# Altium project GameBoard_V1I1.PrjPcb (part 5 of 20)

## Sheet [11] - CPU - JTAG, CONTROL.SchDoc
size A2; DocumentNumber: 11; SheetNumber: 11; SheetTotal: 32
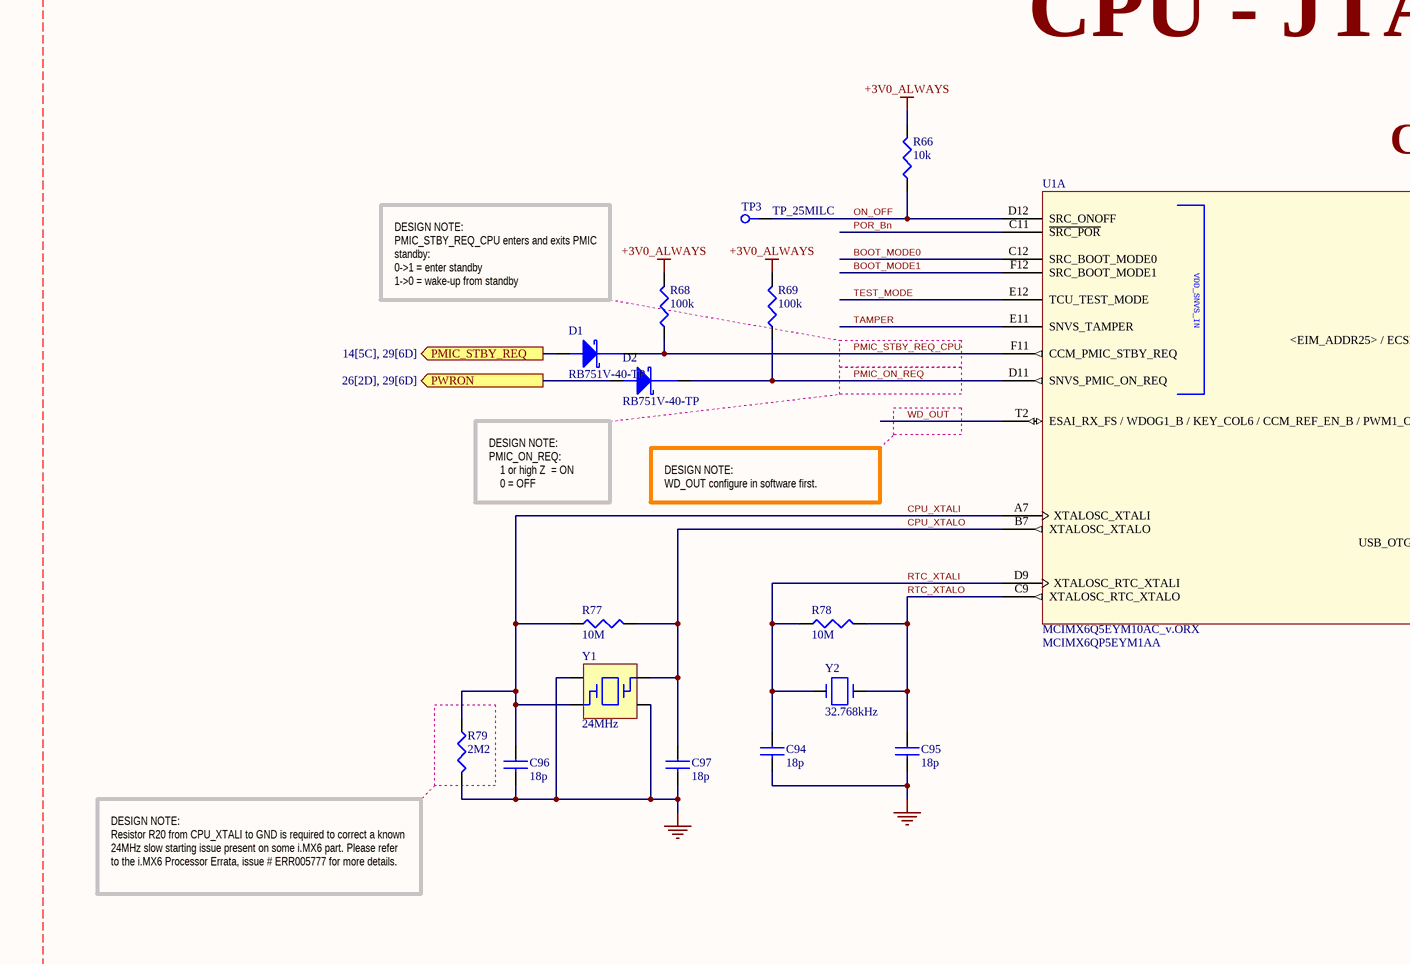
[diagram p30: [11] - CPU - JTAG, CONTROL.SchDoc, top left]
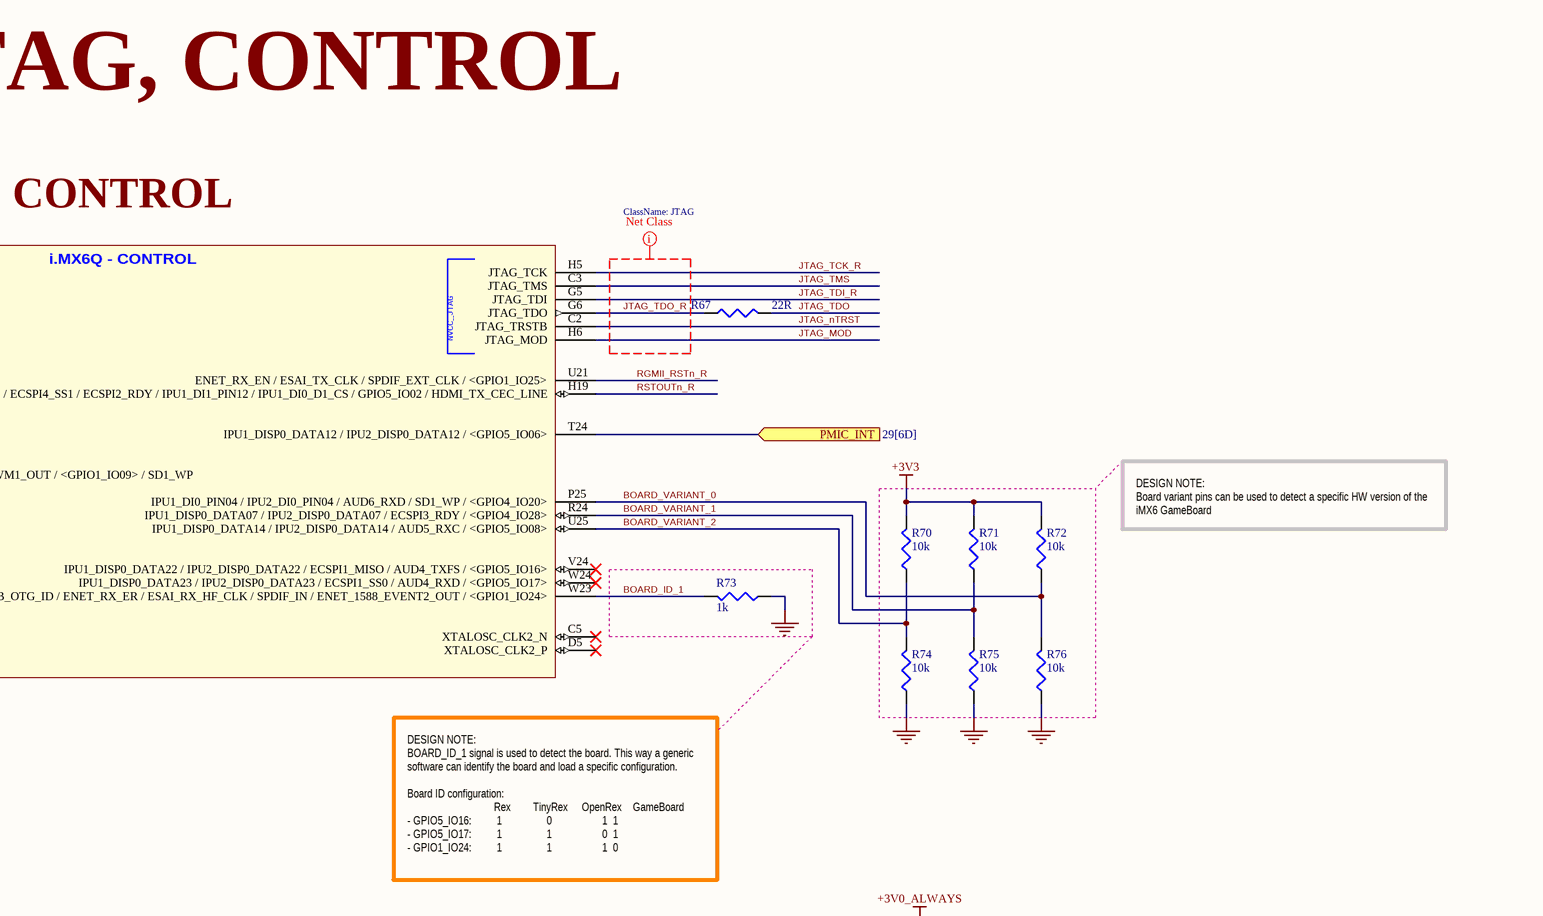
[diagram p31: [11] - CPU - JTAG, CONTROL.SchDoc, top right]
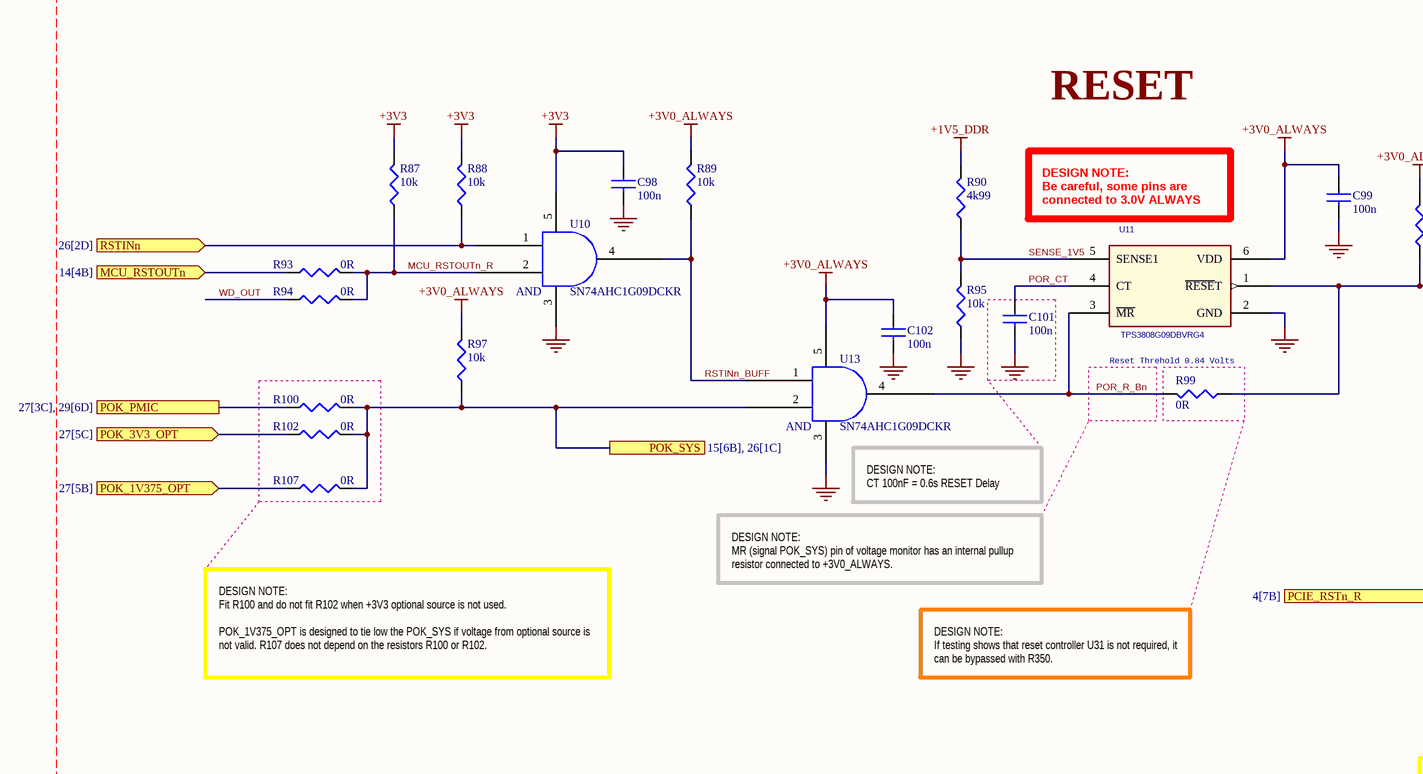
[diagram p32: [11] - CPU - JTAG, CONTROL.SchDoc, bottom left]
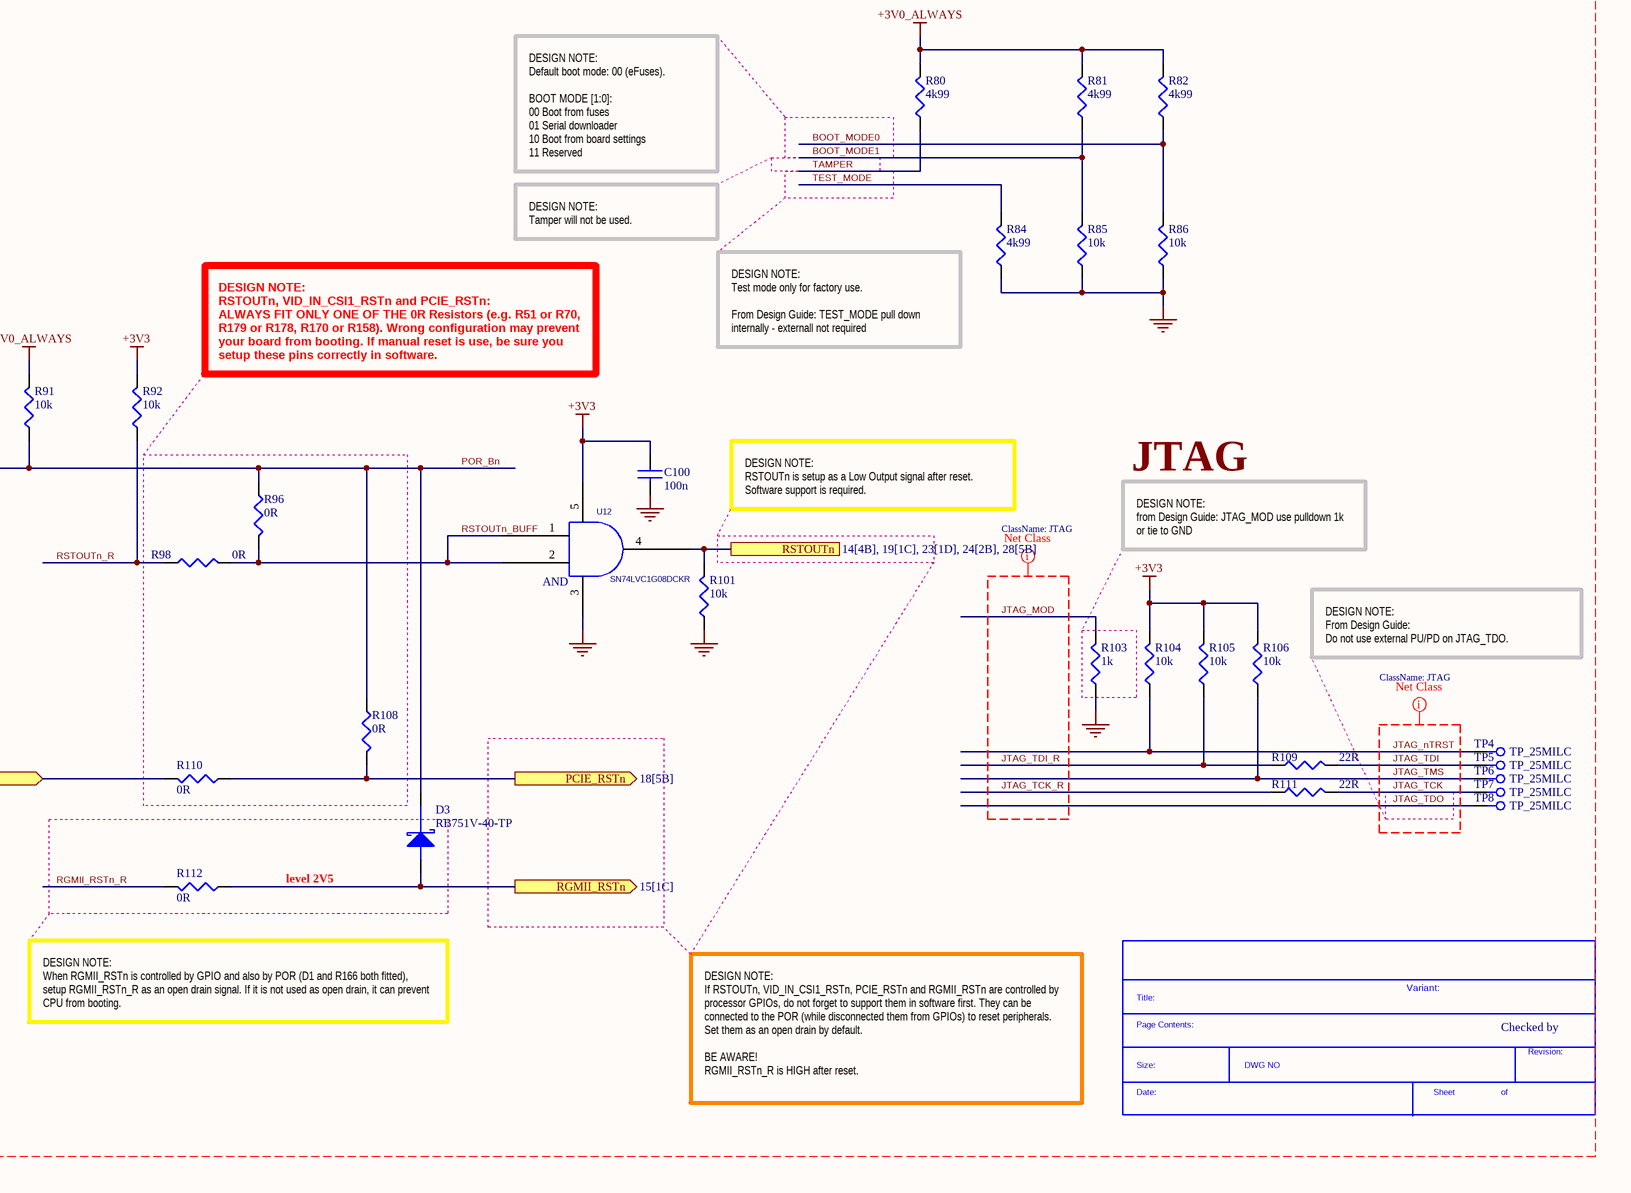
[diagram p33: [11] - CPU - JTAG, CONTROL.SchDoc, bottom right]

### Parts
(Parts that share a designator on the sheet are numbered #1, #2 ... from top to bottom, then left to right.)
*#11  SDTitleBlock  (value not drawn)  (graphical)
C94  18p  [C0201]
C95  18p  [C0201]
C96  18p  [C0402]
C97  18p  [C0402]
C98  100n  [C0402]
C99  100n  [C0402]
C100  100n  [C0402]
C101  100n  [C0402]
C102  100n  [C0402]
D1  RB751V-40-TP  [SOD323]
D2  RB751V-40-TP  [SOD323]
D3  RB751V-40-TP  [SOD323]
R66  10k  [R0402]
R67  22R  [R0402]
R68  100k  [R0402]
R69  100k  [R0402]
R70  10k  [R0402]
R71  10k  [R0402]
R72  10k  [R0402]
R73  1k  [R0402]
R74  10k  [R0402]
R75  10k  [R0402]
R76  10k  [R0402]
R77  10M  [R0402]
R78  10M  [R0201]
R79  2M2  [R0402]
R80  4k99  [R0201]
R81  4k99  [R0402]
R82  4k99  [R0402]
R84  4k99  [R0201]
R85  10k  [R0402]
R86  10k  [R0402]
R87  10k  [R0402]
R88  10k  [R0402]
R89  10k  [R0402]
R90  4k99  [R0402]
R91  10k  [R0402]
R92  10k  [R0402]
R93  0R  [R0402]
R94  0R  [R0402]
R95  10k  [R0402]
R96  0R  [R0402]
R97  10k  [R0402]
R98  0R  [R0402]
R99  0R  [R0402]
R100  0R  [R0402]
R101  10k  [R0402]
R102  0R  [R0402]
R103  1k  [R0201]
R104  10k  [R0402]
R105  10k  [R0402]
R106  10k  [R0402]
R107  0R  [R0402]
R108  0R  [R0402]
R109  22R  [R0402]
R110  0R  [R0402]
R111  22R  [R0402]
R112  0R  [R0402]
TP3  TP_25MILC  [TP_25C]  (no BOM)
TP4  TP_25MILC  [TP_25C]  (no BOM)
TP5  TP_25MILC  [TP_25C]  (no BOM)
TP6  TP_25MILC  [TP_25C]  (no BOM)
TP7  TP_25MILC  [TP_25C]  (no BOM)
TP8  TP_25MILC  [TP_25C]  (no BOM)
U1  MCIMX6Q5EYM10AC_v.ORX  Supplier Part Number 2: MCIMX6QP5EYM1AA  [PBGA624]  (part A of 23)
U10  SN74AHC1G09DCKR  [SC70_5]
U11  TPS3808G09DBVRG4  [DBV_SOT_23_6]
U12  SN74LVC1G08DCKR  [SC70_5]
U13  SN74AHC1G09DCKR  [SC70_5]
Y1  24MHz  [ABM8]
Y2  32.768kHz  [ABS06]

### Blocks framed on the sheet
level 2V5: D3 R112

### Ports
MCU_RSTOUTn (in, see 14[4B]), PCIE_RSTn (out, see 18[5B]), PCIE_RSTn_R (in, see 4[7B]), PMIC_INT (in, see 29[6D]), PMIC_STBY_REQ (out, see 14[5C], 29[6D]), POK_1V375_OPT (in, see 27[5B]), POK_3V3_OPT (in, see 27[5C]), POK_PMIC (see 27[3C], 29[6D]), POK_SYS (see 15[6B], 26[1C]), PWRON (out, see 26[2D], 29[6D]), RGMII_RSTn (out, see 15[1C]), RSTINn (in, see 26[2D]), RSTOUTn (see 14[4B], 19[1C], 23[1D], 24[2B], 28[5B])

### Nets
+1V5_DDR: R90.2
+3V0_ALWAYS: C99.1 C102.1 R66.2 R68.2 R69.2 R80.2 R81.2 R82.2 R89.2 R91.2 R97.2 U11.6(VDD) U13.5(VCC)
+3V3: C98.1 C100.1 R70.2 R71.2 R72.2 R87.2 R88.2 R92.2 R104.2 R105.2 R106.2 U10.5(VCC) U12.5(VCC)
GND: C94.2 C95.2 C96.2 C97.2 C98.2 C99.2 C100.2 C101.2 C102.2 R73.1 R74.1 R75.1 R76.1 R79.2 R84.1 R85.1 R86.1 R95.1 R101.1 R103.1 U10.3(GND) U11.2(GND) U12.3(GND) U13.3(GND) Y1.2 Y1.4
BOARD_ID_1: R73.2 U1.W23(USB_OTG_ID_/_ENET_RX_ER_/_ESAI_RX_HF_CLK_/_SPDIF_IN_/_ENET_1588_EVENT2_OUT_/_<GPIO1_IO24>)
BOARD_VARIANT_0: R72.1 R76.2 U1.P25(IPU1_DI0_PIN04_/_IPU2_DI0_PIN04_/_AUD6_RXD_/_SD1_WP_/_<GPIO4_IO20>)
BOARD_VARIANT_1: R71.1 R75.2 U1.R24(IPU1_DISP0_DATA07_/_IPU2_DISP0_DATA07_/_ECSPI3_RDY_/_<GPIO4_IO28>)
BOARD_VARIANT_2: R70.1 R74.2 U1.U25(IPU1_DISP0_DATA14_/_IPU2_DISP0_DATA14_/_AUD5_RXC_/_<GPIO5_IO08>)
BOOT_MODE0: R82.1 R86.2 U1.C12(SRC_BOOT_MODE0)
BOOT_MODE1: R81.1 R85.2 U1.F12(SRC_BOOT_MODE1)
CPU_XTALI: C96.1 R77.1 R79.1 U1.A7(XTALOSC_XTALI) Y1.3
CPU_XTALO: C97.1 R77.2 U1.B7(XTALOSC_XTALO) Y1.1
JTAG_MOD: R103.2 U1.H6(JTAG_MOD)
JTAG_nTRST: R104.1 TP4.1 U1.C2(JTAG_TRSTB)
JTAG_TCK: R111.2 TP7.1
JTAG_TCK_R: R111.1 U1.H5(JTAG_TCK)
JTAG_TDI: R109.2 TP5.1
JTAG_TDI_R: R105.1 R109.1 U1.G5(JTAG_TDI)
JTAG_TDO: R67.2 TP8.1
JTAG_TDO_R: R67.1 U1.G6(JTAG_TDO)
JTAG_TMS: R106.1 TP6.1 U1.C3(JTAG_TMS)
MCU_RSTOUTn: R93.1 ; port MCU_RSTOUTn
MCU_RSTOUTn_R: R87.1 R93.2 R94.2 U10.2(B)
ON_OFF: R66.1 TP3.1 U1.D12(SRC_ONOFF)
PCIE_RSTn: R108.2 R110.1 ; port PCIE_RSTn
PCIE_RSTn_R: R110.2 ; port PCIE_RSTn_R
PMIC_INT: U1.T24(IPU1_DISP0_DATA12_/_IPU2_DISP0_DATA12_/_<GPIO5_IO06>) ; port PMIC_INT
PMIC_ON_REQ: D2.1(cathode) R69.1 U1.D11(SNVS_PMIC_ON_REQ)
PMIC_STBY_REQ: D1.2(ANODE) ; port PMIC_STBY_REQ
PMIC_STBY_REQ_CPU: D1.1(cathode) R68.1 U1.F11(CCM_PMIC_STBY_REQ)
POK_1V375_OPT: R107.1 ; port POK_1V375_OPT
POK_3V3_OPT: R102.1 ; port POK_3V3_OPT
POK_PMIC: R100.1 ; port POK_PMIC
POK_SYS: R97.1 R100.2 R102.2 R107.2 U13.2(B) ; port POK_SYS
POR_Bn: D3.1(cathode) R91.1 R96.1 R99.1 R108.1 U1.C11(~{SRC_POR}) U11.1(~{RESE}T)
POR_CT: C101.1 U11.4(CT)
POR_R_Bn: R99.2 U11.3(~{MR}) U13.4(Y)
PWRON: D2.2(ANODE) ; port PWRON
RGMII_RSTn: D3.2(ANODE) R112.1 ; port RGMII_RSTn
RGMII_RSTn_R: R112.2 U1.U21(ENET_RX_EN_/_ESAI_TX_CLK_/_SPDIF_EXT_CLK_/_<GPIO1_IO25>)
RSTINn: R88.1 U10.1(A) ; port RSTINn
RSTINn_BUFF: R89.1 U10.4(Y) U13.1(A)
RSTOUTn: R101.2 U12.4(Y) ; port RSTOUTn
RSTOUTn_BUFF: R96.2 R98.2 U12.1(A) U12.2(B)
RSTOUTn_R: R92.1 R98.1 U1.H19(<EIM_ADDR25>_/_ECSPI4_SS1_/_ECSPI2_RDY_/_IPU1_DI1_PIN12_/_IPU1_DI0_D1_CS_/_GPIO5_IO02_/_HDMI_TX_CEC_LINE)
RTC_XTALI: C94.1 R78.1 U1.D9(XTALOSC_RTC_XTALI) Y2.1
RTC_XTALO: C95.1 R78.2 U1.C9(XTALOSC_RTC_XTALO) Y2.2
SENSE_1V5: R90.1 R95.2 U11.5(SENSE1)
TAMPER: R80.1 U1.E11(SNVS_TAMPER)
TEST_MODE: R84.2 U1.E12(TCU_TEST_MODE)
WD_OUT: R94.1 U1.T2(ESAI_RX_FS_/_WDOG1_B_/_KEY_COL6_/_CCM_REF_EN_B_/_PWM1_OUT_/_<GPIO1_IO09>_/_SD1_WP)

Not connected (* = marked no-connect by the designer): U1 C5(XTALOSC_CLK2_N)* D5(XTALOSC_CLK2_P)* V24(IPU1_DISP0_DATA22_/_IPU2_DISP0_DATA22_/_ECSPI1_MISO_/_AUD4_TXFS_/_<GPIO5_IO16>)* W24(IPU1_DISP0_DATA23_/_IPU2_DISP0_DATA23_/_ECSPI1_SS0_/_AUD4_RXD_/_<GPIO5_IO17>)*

### Layout directives
net class JTAG: JTAG_MOD, JTAG_nTRST, JTAG_TCK, JTAG_TCK_R, JTAG_TDI, JTAG_TDI_R, JTAG_TDO, JTAG_TDO_R, JTAG_TMS
net class [11] - CPU - JTAG/CONTROL: +1V5_DDR, +3V0_ALWAYS, +3V3, BOARD_ID_1, BOARD_VARIANT_0, BOARD_VARIANT_1, BOARD_VARIANT_2, BOOT_MODE0, BOOT_MODE1, CPU_XTALI, CPU_XTALO, GND, JTAG_MOD, JTAG_nTRST, JTAG_TCK, JTAG_TCK_R, JTAG_TDI, JTAG_TDI_R, JTAG_TDO, JTAG_TDO_R, JTAG_TMS, MCU_RSTOUTn_R, ON_OFF, PMIC_ON_REQ, PMIC_STBY_REQ_CPU, POR_Bn, POR_CT, POR_R_Bn, RGMII_RSTn_R, RSTINn_BUFF, RSTOUTn_BUFF, RSTOUTn_R, RTC_XTALI, RTC_XTALO, SENSE_1V5, TAMPER, TEST_MODE, WD_OUT

### Notes on the sheet
- CPU - JTAG, CONTROL
- CONTROL
- DESIGN NOTE:
  PMIC_STBY_REQ_CPU enters and exits PMIC standby:
  0->1 = enter standby
  1->0 = wake-up from standby
- DESIGN NOTE:
  PMIC_ON_REQ:
  1 or high Z  = ON
  0 = OFF
- DESIGN NOTE:
  WD_OUT configure in software first.
- DESIGN NOTE:
  Board variant pins can be used to detect a specific HW version of the iMX6 GameBoard
- DESIGN NOTE:
  BOARD_ID_1 signal is used to detect the board. This way a generic software can identify the board and load a specific configuration.
  Board ID configuration:
  Rex        TinyRex     OpenRex    GameBoard
  - GPIO5_IO16:         1                0                  1		1
  - GPIO5_IO17:         1                1                  0		1
  - GPIO1_IO24:         1                1                  1		0
- DESIGN NOTE:
  Resistor R20 from CPU_XTALI to GND is required to correct a known 24MHz slow starting issue present on some i.MX6 part. Please refer to the i.MX6 Processor Errata, issue # ERR005777 for more details.
- DESIGN NOTE:
  Default boot mode: 00 (eFuses).
  BOOT MODE [1:0]:
  00 Boot from fuses
  01 Serial downloader
  10 Boot from board settings
  11 Reserved
- DESIGN NOTE:
  Tamper will not be used.
- RESET
- DESIGN NOTE:
  RSTOUTn, VID_IN_CSI1_RSTn and PCIE_RSTn:
  ALWAYS FIT ONLY ONE OF THE 0R Resistors (e.g. R51 or R70, R179 or R178, R170 or R158). Wrong configuration may prevent your board from booting. If manual reset is use, be sure you setup these pins correctly in software.
- DESIGN NOTE:
  Test mode only for factory use.
  From Design Guide: TEST_MODE pull down internally - externall not required
- (near U11) DESIGN NOTE:
  Be careful, some pins are connected to 3.0V ALWAYS
- DESIGN NOTE:
  RSTOUTn is setup as a Low Output signal after reset. Software support is required.
- JTAG
- Reset Threhold 0.84 Volts
- DESIGN NOTE:
  from Design Guide: JTAG_MOD use pulldown 1k or tie to GND
- (near U13) DESIGN NOTE:
  CT 100nF = 0.6s RESET Delay
- DESIGN NOTE:
  From Design Guide:
  Do not use external PU/PD on JTAG_TDO.
- DESIGN NOTE:
  MR (signal POK_SYS) pin of voltage monitor has an internal pullup resistor connected to +3V0_ALWAYS.
- DESIGN NOTE:
  Fit R100 and do not fit R102 when +3V3 optional source is not used.
  POK_1V375_OPT is designed to tie low the POK_SYS if voltage from optional source is not valid. R107 does not depend on the resistors R100 or R102.
- DESIGN NOTE:
  If testing shows that reset controller U31 is not required, it can be bypassed with R350.
- DESIGN NOTE:
  When RGMII_RSTn is controlled by GPIO and also by POR (D1 and R166 both fitted), setup RGMII_RSTn_R as an open drain signal. If it is not used as open drain, it can prevent CPU from booting.
- Variant:
- Checked by
- (near *#11) DESIGN NOTE:
  If RSTOUTn, VID_IN_CSI1_RSTn, PCIE_RSTn and RGMII_RSTn are controlled by processor GPIOs, do not forget to support them in software first. They can be connected to the POR (while disconnected them from GPIOs) to reset peripherals. Set them as an open drain by default.
  BE AWARE!
  RGMII_RSTn_R is HIGH after reset.
- (in symbol MCIMX6Q5EYM10AC_v.ORX, part A) i.MX6Q - CONTROL
- (in symbol SDTitleBlock) Title:; Page Contents:; Revision:; Size:; DWG NO; Date:; Sheet; of
- (in symbol SN74AHC1G09DCKR) AND
- (in symbol SN74LVC1G08DCKR) AND

### Library data of the parts
C94 C95 = C0603C0G1H180J030BA: CAP CER 18PF 50V 5% C0G 0201; Manufacturer: TDK Corporation; Temperature Coefficient: C0G, NP0; .Creator: MM; .Checked PCB: used; Dielectric Material: Ceramic; Manufacturer Part Number: C0603C0G1H180J030BA; RoHS: RoHS Compliant; Category: Capacitors; Packaging: Cut Tape (CT); Capacitance: 18pF; Tolerance: ±5%; Voltage - Rated: 50V; Mounting Type: Surface Mount, MLCC; Operating Temperature: -55°C ~ 125°C; Applications: General Purpose; Ratings: -; Package / Case: 0201 (0603 Metric); Size / Dimension: 0.024" L x 0.012" W (0.60mm x 0.30mm); Height - Seated (Max): -; Thickness (Max): 0.013" (0.33mm); Lead Spacing: -; Features: -; Lead Style: -; ComponentLink1URL: http://product.tdk.com/en/catalog/datasheets/mlcc_commercial_general_en.pdf; ComponentLink1Description: http://product.tdk.com/en/catalog/datasheets/mlcc_commercial_general_en.pdf; .Checked SCH: used; Mount: Surface Mount; Case/Package: 0201; Number of Pins: 2; Weight: 6E-06oz; Case Code (Metric): 0603; Case Code (Imperial): 0201; Min Operating Temperature: -55°C; Max Operating Temperature: 125°C; Package Quantity: 15000; Voltage Rating: 50V; Voltage Rating (DC): 50V; Dielectric: C0G; Termination: SMD/SMT; Voltage: 50V; Length: 0.6mm; Height: 0.3mm; Width: 0.012inch; Depth: 0.3mm; Thickness: 0.013inch; Lead Free: Lead Free; REACH SVHC: Unknown; Composition: Ceramic; Supplier 1: Digi-Key; Supplier Part Number 1: 445-1777-1-ND
C96 C97 = C1005C0G1H180J: CAP CER 18PF 50V C0G 5% 0402; Manufacturer: TDK Corporation; .Checked PCB: used; Temperature Coefficient: C0G, NP0; Capacitance: 18pF; Category: Capacitors; Supplier Part Number: 445-1238-1-ND; Manufacturer Part Number: C1005C0G1H180J; Operating Temperature: -55°C ~ 125°C; Package / Case: 0402 (1005 Metric); Price 1k [$]: 0.00468; Value: 18pF; .Checked SCH: used; Voltage - Rated: 50V; Supplier: Digikey; Supplier 1: Digi-Key; Supplier Part Number 1: 445-1238-1-ND; RoHS: RoHS Compliant; Stock 1: 24321; Pricing 1: 1=0.08, 10=0.05, 100=0.018, 250=0.013, 500=0.0096, 1000=0.0065 (USD); Tolerance: ±5%; Mounting Type: Surface Mount, MLCC; Applications: General Purpose; Ratings: -; Size / Dimension: 0.039" L x 0.020" W (1.00mm x 0.50mm); Height - Seated (Max): -; Thickness (Max): 0.022" (0.55mm); Lead Spacing: -; Features: -; Packaging: Cut Tape (CT); Lead Style: -; ComponentLink1URL: http://www.tdk.co.jp/tefe02/e412_c.pdf; ComponentLink1Description: http://www.tdk.co.jp/tefe02/e412_c.pdf
C98-C102 = C1005X5R1H104K: CAP CER .10UF 50V X5R 10% 0402; Manufacturer: TDK Corporation; Capacitance: 0.1µF; Value: 100nF; .Checked PCB: used; Category: Capacitors; Manufacturer Part Number: C1005X5R1H104K; Operating Temperature: -55°C ~ 85°C; Package / Case: 0402 (1005 Metric); Price 1k [$]: 0.02340; .Checked SCH: used; Voltage - Rated: 50V; Supplier Part Number: 445-5942-1-ND; Supplier: Digikey; Supplier 1: Digi-Key; Supplier Part Number 1: 445-5942-1-ND; RoHS: RoHS Compliant; Stock 1: 106926; Pricing 1: 1=0.27, 10=0.18, 100=0.072, 250=0.05176, 500=0.0369, 1000=0.027 (USD); Tolerance: ±10%; Temperature Coefficient: X5R; Mounting Type: Surface Mount, MLCC; Applications: General Purpose; Ratings: -; Size / Dimension: 0.039" L x 0.020" W (1.00mm x 0.50mm); Height - Seated (Max): -; Thickness (Max): 0.022" (0.55mm); Lead Spacing: -; Features: -; Packaging: Cut Tape (CT); Lead Style: -; ComponentLink1URL: http://www.tdk.co.jp/tefe02/e412_c.pdf; ComponentLink1Description: http://www.tdk.co.jp/tefe02/e412_c.pdf; Supplier 2: Digi-Key; Supplier Part Number 2: 311-1697-6-ND
D1-D3 = RB751V-40-TP: DIODE SCHTKY 30MA 30V SOD-323; Manufacturer: Micro Commercial Co; Diode Type: Schottky; Voltage - Forward (Vf) (Max) @ If: 370mV @ 1mA; Speed: Small Signal =< 200mA (Io), Any Speed; Current - Reverse Leakage @ Vr: 500nA @ 30V; Capacitance @ Vr, F: 2pF @ 1V, 1MHz; .Checked PCB: used; Supplier 1: Digi-Key; Supplier Part Number 1: RB751V-40-TPMSCT-ND; Manufacturer Part Number: RB751V-40-TP; RoHS: RoHS Compliant; Category: Discrete Semiconductor Products; Stock 1: 18964; Pricing 1: 1=0.48, 10=0.342, 100=0.2014, 250=0.14252, 500=0.1216, 1000=0.095 (USD); Voltage - DC Reverse (Vr) (Max): 30V; Current - Average Rectified (Io): 30mA; Reverse Recovery Time (trr): -; Mounting Type: Surface Mount; Package / Case: SC-76, SOD-323; Supplier Device Package: SOD-323; Packaging: Cut Tape (CT); ComponentLink1URL: http://www.mccsemi.com/up_pdf/RB751V-40(SOD-323).PDF; ComponentLink1Description: Data Sheet; .Checked SCH: used
R66 R70-R72 R74-R76 R85-R89 R91 R92 R95 R97 R101 R104-R106 = RC0402FR-0710KL: RES 10.0K OHM 1/16W 1% 0402 SMD; Manufacturer: Yageo; Power (Watts): 0.063W, 1/16W; .Checked PCB: used; Temperature Coefficient: ±100ppm/°C; Category: Resistors; Supplier Part Number: 311-10.0KLRCT-ND; Manufacturer Part Number: RC0402FR-0710KL; Package / Case: 0402 (1005 Metric); Price 1k [$]: 0.01421; Resistance (Ohms): 10K; Tolerance: ±1%; Value: 10k; .Checked SCH: used; Supplier: Digikey; Supplier 1: Digi-Key; Supplier Part Number 1: 311-10.0KLRCT-ND; RoHS: RoHS Compliant; Stock 1: 2916495; Pricing 1: 10=0.014, 50=0.0104, 100=0.0079, 250=0.00584, 500=0.00432, 1000=0.00288 (USD); Composition: Thick Film; Features: -; Size / Dimension: 0.039" L x 0.020" W (1.00mm x 0.50mm); Height: 0.016" (0.40mm); Number of Terminations: 2; Packaging: Cut Tape (CT); ComponentLink1URL: http://www.yageo.com/documents/recent/PYu-RC0402_51_RoHS_L_6.pdf; ComponentLink1Description: http://www.yageo.com/documents/recent/PYu-RC0402_51_RoHS_L_6.pdf
R67 R109 R111 = RC0402FR-0722RL: RES 22.0 OHM 1/16W 1% 0402 SMD; Manufacturer: Yageo; Resistance (Ohms): 22; Power (Watts): 0.063W, 1/16W; .Checked PCB: used; Temperature Coefficient: ±100ppm/°C; Category: Resistors; Supplier Part Number: 311-22.0LRCT-ND; Manufacturer Part Number: RC0402FR-0722RL; Package / Case: 0402 (1005 Metric); Price 1k [$]: 0.01421; Tolerance: ±1%; Value: 22R; .Checked SCH: used; Supplier: Digikey; Supplier 1: Digi-Key; Supplier Part Number 1: 311-22.0LRCT-ND; RoHS: RoHS Compliant; Stock 1: 943800; Pricing 1: 10=0.014, 50=0.0104, 100=0.0079, 250=0.00584, 500=0.00432, 1000=0.00288 (USD); Composition: Thick Film; Features: -; Size / Dimension: 0.039" L x 0.020" W (1.00mm x 0.50mm); Height: 0.016" (0.40mm); Number of Terminations: 2; Packaging: Cut Tape (CT); ComponentLink1URL: http://www.yageo.com/documents/recent/PYu-RC0402_51_RoHS_L_6.pdf; ComponentLink1Description: http://www.yageo.com/documents/recent/PYu-RC0402_51_RoHS_L_6.pdf
R68 R69 = RMCF0402FT100K: RES 100K OHM 1/16W 1% 0402 SMD; Manufacturer: Stackpole Electronics Inc; Power (Watts): 0.063W, 1/16W; .Checked PCB: used; Temperature Coefficient: ±100ppm/°C; Category: Resistors; Supplier Part Number: RMCF0402FT100KCT-ND; Manufacturer Part Number: RMCF0402FT100K; Package / Case: 0402 (1005 Metric); Price 1k [$]: 0.00384; Resistance (Ohms): 100K; Tolerance: ±1%; Value: 100k; .Checked SCH: used; Supplier: Digikey; Supplier 1: Digi-Key; Supplier Part Number 1: YAG1343DKR-ND; RoHS: RoHS Compliant; Composition: Thick Film; Features: -; Size / Dimension: 0.039" L x 0.020" W (1.00mm x 0.50mm); Height: 0.016" (0.40mm); Number of Terminations: 2; Packaging: Cut Tape (CT); ComponentLink1URL: http://www.seielect.com/Catalog/SEI-RMCF.pdf; ComponentLink1Description: http://www.seielect.com/Catalog/SEI-RMCF.pdf
R73 = RC0402FR-071KL: RES 1.00K OHM 1/16W 1% 0402 SMD; Manufacturer: Yageo; Power (Watts): 0.063W, 1/16W; .Checked PCB: used; Temperature Coefficient: ±100ppm/°C; Category: Resistors; Supplier Part Number: 311-1.00KLRCT-ND; Manufacturer Part Number: RC0402FR-071KL; Package / Case: 0402 (1005 Metric); Price 1k [$]: 0.01421; Resistance (Ohms): 1K; Tolerance: ±1%; Value: 1k; .Checked SCH: used; Supplier: Digikey; Supplier 1: Digi-Key; Supplier Part Number 1: 311-1.00KLRCT-ND; RoHS: RoHS Compliant; Stock 1: 1753477; Pricing 1: 10=0.014, 50=0.0104, 100=0.0079, 250=0.00584, 500=0.00432, 1000=0.00288 (USD); Composition: Thick Film; Features: -; Size / Dimension: 0.039" L x 0.020" W (1.00mm x 0.50mm); Height: 0.016" (0.40mm); Number of Terminations: 2; Packaging: Cut Tape (CT); ComponentLink1URL: http://www.yageo.com/documents/recent/PYu-RC0402_51_RoHS_L_6.pdf; ComponentLink1Description: http://www.yageo.com/documents/recent/PYu-RC0402_51_RoHS_L_6.pdf
R77 = CRCW040210M0FKED: RES 10.0M OHM 1/16W 1% 0402 SMD; Manufacturer: Vishay Dale; Power (Watts): 0.063W, 1/16W; Temperature Coefficient: ±100ppm/°C; .Checked PCB: used; Supplier 1: Digi-Key; Supplier Part Number 1: 541-10.0MLCT-ND; Manufacturer Part Number: CRCW040210M0FKED; RoHS: RoHS Compliant; Category: Resistors; Stock 1: 182279; Pricing 1: 10=0.083, 50=0.0444, 200=0.0255, 1000=0.0174 (USD); Resistance (Ohms): 10M; Composition: Thick Film; Features: -; Tolerance: ±1%; Package / Case: 0402 (1005 Metric); Size / Dimension: 0.039" L x 0.020" W (1.00mm x 0.50mm); Height: 0.016" (0.40mm); Number of Terminations: 2; Packaging: Cut Tape (CT); ComponentLink1URL: http://www.vishay.com/doc?20035; ComponentLink1Description: http://www.vishay.com/doc?20035; .Checked SCH: used; Supplier 2: Digi-Key; Supplier Part Number 2: 311-10.0MLRCT-ND
R78 = MCR006YZPF1005: RES 10M OHM 1/20W 1% 0201 SMD; Manufacturer: Rohm Semiconductor; Power (Watts): 0.05W, 1/20W; Temperature Coefficient: ±250ppm/°C; .Creator: MM; .Checked PCB: used; Supplier 1: Digi-Key; Manufacturer Part Number: MCR006YZPF1005; RoHS: RoHS Compliant; Category: Resistors; Stock 1: 88250; Pricing 1: 1=0.1, 10=0.064, 25=0.0464, 100=0.026, 250=0.0198, 500=0.01584, 1000=0.01166, 5000=0.00836 (USD); Packaging: Cut Tape (CT); Resistance (Ohms): 10M; Tolerance: ±1%; Composition: Thick Film; Features: Automotive AEC-Q200 Qualified; Package / Case: 0201 (0603 Metric); Supplier Device Package: 0201 (0603 Metric); Size / Dimension: 0.024" L x 0.012" W (0.60mm x 0.30mm); Height: 0.010" (0.26mm); Number of Terminations: 2; ComponentLink1URL: http://rohmfs.rohm.com/en/products/databook/datasheet/passive/resistor/chip_resistor/mcr_a.pdf; ComponentLink1Description: http://rohmfs.rohm.com/en/products/databook/datasheet/passive/resistor/chip_resistor/mcr_a.pdf; Supplier Part Number 1: RHM10MABCT-ND; .Checked SCH: used; Supplier 2: Digi-Key; Supplier Part Number 2: YAG2861CT-ND
R79 = CRCW04022M20FKED: RES 2.20M OHM 1/16W 1% 0402 SMD; Manufacturer: Vishay Dale; Resistance (Ohms): 2.2M; Power (Watts): 0.063W, 1/16W; Temperature Coefficient: ±100ppm/°C; .Creator: MM; .Checked PCB: used; Supplier 1: Digi-Key; Manufacturer Part Number: CRCW04022M20FKED; RoHS: RoHS Compliant; Category: Resistors; Stock 1: 77953; Pricing 1: 10=0.083, 50=0.0444, 200=0.0255, 1000=0.0174 (USD); Composition: Thick Film; Features: Automotive AEC-Q200 Qualified; Tolerance: ±1%; Package / Case: 0402 (1005 Metric); Supplier Device Package: 0402 (1005 Metric); Size / Dimension: 0.039" L x 0.020" W (1.00mm x 0.50mm); Height: 0.016" (0.40mm); Number of Terminations: 2; Packaging: Cut Tape (CT); ComponentLink1URL: http://www.vishay.com/doc?20035; ComponentLink1Description: http://www.vishay.com/doc?20035; Supplier Part Number 1: 541-2.20MLCT-ND; .Checked SCH: used; Supplier 2: Digi-Key; Supplier Part Number 2: 1276-4295-1-ND
R80 R84 = RMCF0201FT4K99: RES 4.99K OHM 1/20W 1% 0201; Manufacturer: Stackpole Electronics Inc; Power (Watts): 0.05W, 1/20W; Temperature Coefficient: ±200ppm/°C; .Creator: MM; .Checked PCB: used; Supplier 1: Digi-Key; Manufacturer Part Number: RMCF0201FT4K99; RoHS: RoHS Compliant; Category: Resistors; Stock 1: 28120; Pricing 1: 1=0.11, 10=0.074, 50=0.0402, 100=0.0306, 250=0.02276, 500=0.0168, 1000=0.0112, 2500=0.00945, 5000=0.00788 (USD); Packaging: Cut Tape (CT); Resistance (Ohms): 4.99k; Tolerance: ±1%; Composition: Thick Film; Features: -; Package / Case: 0201 (0603 Metric); Supplier Device Package: 0201; Size / Dimension: 0.024" L x 0.012" W (0.60mm x 0.30mm); Height: 0.009" (0.24mm); Number of Terminations: 2; ComponentLink1URL: http://www.seielect.com/Catalog/SEI-RMCF_RMCP.pdf; ComponentLink1Description: http://www.seielect.com/Catalog/SEI-RMCF_RMCP.pdf; Supplier Part Number 1: RMCF0201FT4K99CT-ND; .Checked SCH: used
R81 R82 R90 = RMCF0402FT4K99: RES TF 4.99K OHM 1% 1/16W 0402; Manufacturer: Stackpole Electronics Inc; Power (Watts): 0.063W, 1/16W; .Checked PCB: used; Temperature Coefficient: ±100ppm/°C; Category: Resistors; Supplier Part Number: RMCF0402FT4K99CT-ND; Manufacturer Part Number: RMCF0402FT4K99; Package / Case: 0402 (1005 Metric); Price 1k [$]: 0.00384; Resistance (Ohms): 4.99K; Tolerance: ±1%; Value: 4k99; .Checked SCH: used; Supplier: Digikey; Supplier 1: Digi-Key; Supplier Part Number 1: RMCF0402FT4K99CT-ND; RoHS: RoHS Compliant; Stock 1: 48509; Pricing 1: 1=0.04, 10=0.025, 50=0.0138, 100=0.0105, 250=0.0078, 500=0.00576, 1000=0.00384 (USD); Composition: Thick Film; Features: -; Size / Dimension: 0.039" L x 0.020" W (1.00mm x 0.50mm); Height: 0.016" (0.40mm); Number of Terminations: 2; Packaging: Cut Tape (CT); ComponentLink1URL: http://www.seielect.com/Catalog/SEI-RMCF.pdf; ComponentLink1Description: http://www.seielect.com/Catalog/SEI-RMCF.pdf
R93 R94 R96 R98-R100 R102 R107 R108 R110 R112 = RC0402JR-070RL: RES 0.0 OHM 1/16W 0402 SMD; Manufacturer: Yageo; Resistance (Ohms): 0.0; Power (Watts): 0.063W, 1/16W; Tolerance: Jumper; .Checked PCB: used; Category: Resistors; Supplier Part Number: 311-0.0JRCT-ND; Manufacturer Part Number: RC0402JR-070RL; Package / Case: 0402 (1005 Metric); Price 1k [$]: 0.01389; Value: 0R; .Checked SCH: used; Supplier: Digikey; Supplier 1: Digi-Key; Supplier Part Number 1: 311-0.0JRCT-ND; RoHS: RoHS Compliant; Stock 1: 1106330; Pricing 1: 10=0.012, 50=0.009, 100=0.0069, 250=0.00512, 500=0.0038, 1000=0.00253 (USD); Composition: Thick Film; Features: -; Temperature Coefficient: -; Size / Dimension: 0.039" L x 0.020" W (1.00mm x 0.50mm); Height: 0.016" (0.40mm); Number of Terminations: 2; Packaging: Cut Tape (CT); ComponentLink1URL: http://www.yageo.com/documents/recent/PYu-RC0402_51_RoHS_L_6.pdf; ComponentLink1Description: http://www.yageo.com/documents/recent/PYu-RC0402_51_RoHS_L_6.pdf
R103 = RC0201FR-071KL: RES 1K OHM 1/20W 1% 0201 SMD; Manufacturer: Yageo; Power (Watts): 0.05W, 1/20W; Temperature Coefficient: ±200ppm/°C; .Creator: MM; .Checked PCB: used; Supplier 1: Digi-Key; Manufacturer Part Number: RC0201FR-071KL; RoHS: RoHS Compliant; Category: Resistors; Stock 1: 0; Pricing 1: 1=0.1, 10=0.074, 25=0.054, 100=0.0303, 250=0.02312, 500=0.0185, 1000=0.01361, 2500=0.01182, 5000=0.00976 (USD); Packaging: Cut Tape (CT); Resistance (Ohms): 1k; Tolerance: ±1%; Composition: Thick Film; Features: Moisture Resistant; Package / Case: 0201 (0603 Metric); Supplier Device Package: 0201; Size / Dimension: 0.024" L x 0.012" W (0.60mm x 0.30mm); Height: 0.010" (0.26mm); Number of Terminations: 2; ComponentLink1URL: http://www.yageo.com/documents/recent/PYu-RC0201_51_RoHS_L_8.pdf; ComponentLink1Description: http://www.yageo.com/documents/recent/PYu-RC0201_51_RoHS_L_8.pdf; Supplier Part Number 1: 311-1KMCT-ND; .Checked SCH: used
TP3-TP8 = TP_25MILC: Test Point 25mil; .Checked PCB: used
U1 = MCIMX6Q5EYM10AC_v.ORX: IC MCU 32BIT ARM QUAD 624FCBGA; Manufacturer: Freescale Semiconductor; Core Processor: ARM® Cortex™-A9; Core Size: 32-Bit Quad-Core; Speed: 1.0GHz; Connectivity: CAN, EBI/EMI, ESAI, Ethernet, GPMI, I2C, MMC/SD, PCI, SATA, SPI, UART, USB, USB OTG; Peripherals: DMA, HDMI, I2S/SSI/AC97, MIPI CSI, MIMI DSI, MIPI HIS, PWM, WDT; Number of I /O: 224; Program Memory Type: External Program Memory; RAM Size: 256K x 8; Voltage - Supply (Vcc/Vdd): 0.925 V ~ 1.5 V; Oscillator Type: Internal; .Creator: MM; .Checked PCB: used; Supplier 1: Digi-Key; Manufacturer Part Number: MCIMX6Q5EYM10AC; RoHS: RoHS Compliant; Category: Integrated Circuits (ICs); Stock 1: 0; Pricing 1: 1=54.98, 10=51.922, 25=48.868, 100=30.5424 (USD); Program Memory Size: -; EEPROM Size: -; Data Converters: -; Operating Temperature: -20°C ~ 105°C; Package / Case: 624-FBGA, FCBGA; Packaging: Tray; ComponentLink1URL: http://cache.freescale.com/files/32bit/doc/data_sheet/IMX6DQCEC.pdf; ComponentLink1Description: Data Sheet; Supplier Part Number 1: MCIMX6Q5EYM10AC-ND; .Checked SCH: used; ComponentLink2Description: User Guide; ComponentLink2URL: file:///C:/Users/mbeach/Downloads/i.MX_Linux_User's_Guide.pdf; Supplier 2: Arrow
U10 U13 = SN74AHC1G09DCKR: IC GATE AND 1CH 2-INP SC-70-5; Manufacturer: Texas Instruments; Logic Type: AND Gate; Number of Circuits: 1; Number of Inputs: 2; Voltage - Supply: 2 V ~ 5.5 V; Current - Quiescent (Max): 1µA; Current - Output High, Low: -, 8mA; Logic Level - Low: 0.5 V ~ 1.65 V; Logic Level - High: 1.5 V ~ 3.85 V; Max Propagation Delay @ V, Max CL: 7.5ns @ 5V, 50pF; .Creator: MM; .Checked SCH: used; Supplier 1: Digi-Key; Manufacturer Part Number: SN74AHC1G09DCKR; RoHS: RoHS Compliant; Category: Integrated Circuits (ICs); Stock 1: 2059; Pricing 1: 1=0.49, 10=0.345, 25=0.2836, 100=0.2265, 250=0.165, 500=0.134, 750=0.11351, 1000=0.103 (USD); Packaging: Cut Tape (CT); Features: Open Drain; Operating Temperature: -55°C ~ 125°C; Mounting Type: Surface Mount; Supplier Device Package: SC-70-5; Package / Case: 6-TSSOP (5 Lead), SC-88A, SOT-353; ComponentLink1URL: http://www.ti.com/lit/ds/symlink/sn74ahc1g09.pdf; ComponentLink1Description: http://www.ti.com/lit/ds/symlink/sn74ahc1g09.pdf; Supplier Part Number 1: 296-29203-1-ND; .Checked PCB: used
U11 = TPS3808G09DBVR: IC VOLT SUPERVISOR 0.9V SOT23-6; Part #: 102020-0009R; Manufacturer: Texas Instruments; .Checked PCB: used; Number of Voltages Monitored: 1; Output: Open Drain or Open Collector; Reset: Active Low; Reset Timeout: Adjustable/Selectable; Voltage - Threshold: 0.84V; .Checked SCH: used; Category: Integrated Circuits (ICs); Supplier Part Number: 296-17189-1-ND; Family: PMIC - Supervisors; Manufacturer Part Number: TPS3808G09DBVR; Operating Temperature: -40°C ~ 125°C; Package / Case: SOT-23-6; Price 1k [$]: 1.12000; Value: TPS3808G09DBVR; Type: Simple Reset/Power-On Reset; Supplier: Digikey; Supplier 1: Digi-Key; Supplier Part Number 1: 296-17189-1-ND; RoHS: RoHS Compliant; Stock 1: 61681; Pricing 1: 1=2.45, 25=1.89, 100=1.715, 250=1.54, 500=1.33, 1000=1.12 (USD); Mounting Type: Surface Mount; Supplier Device Package: SOT-23-6; Packaging: Cut Tape (CT); ComponentLink1URL: http://www.ti.com/lit/ds/symlink/tps3808g01.pdf; ComponentLink1Description: http://www.ti.com/lit/ds/symlink/tps3808g01.pdf
U12 = SN74LVC1G08DCKR: SINGLE POSITIVE AND GATE SC-70; Manufacturer: Texas Instruments; .Checked PCB: used; Number of Inputs: 2; Voltage - Supply: 1.65 V ~ 5.5 V; Number of Circuits: 1; Current - Output High, Low: 32mA, 32mA; .Checked SCH: used; Category: Integrated Circuits (ICs); Supplier Part Number: 296-11602-1-ND; Family: Logic - Gates and Inverters; Manufacturer Part Number: SN74LVC1G08DCKR; Operating Temperature: -40°C ~ 85°C; Package / Case: 6-TSSOP (5 lead), SC-88A, SOT-353; Price 1k [$]: 0.11250; Value: SN74LVC1G08DCKR; Logic Type: AND Gate; Supplier: Digikey; Supplier 1: Digi-Key; Supplier Part Number 1: 296-11602-1-ND; RoHS: RoHS Compliant; Stock 1: 36212; Pricing 1: 1=0.7, 25=0.322, 100=0.224, 250=0.1596, 500=0.1218, 1000=0.084 (USD); Mounting Type: Surface Mount; Supplier Device Package: SC-70-5; Packaging: Cut Tape (CT); ComponentLink1URL: http://www.ti.com/lit/ds/symlink/sn74lvc1g08.pdf; ComponentLink1Description: http://www.ti.com/lit/ds/symlink/sn74lvc1g08.pdf
Y1 = ABM8-24.000MHZ-R60-D-1-W-T: CRYSTAL 24MHZ 18PF SMD; Manufacturer: Abracon Corporation; Frequency Stability: ±25ppm; Frequency Tolerance: ±10ppm; ESR (Equivalent Series Resistance): 50 Ohm; Operating Mode: Fundamental; .Creator: MM; .Checked PCB: used; Supplier 1: Digi-Key; Manufacturer Part Number: ABM8-24.000MHZ-R60-D-1-W-T; RoHS: RoHS Compliant; Category: Crystals and Oscillators; Stock 1: 11496; Pricing 1: 1=1.42, 10=1.356, 50=1.326, 100=1.134, 500=1.104 (USD); Packaging: Cut Tape (CT); Type: MHz Crystal; Frequency: 24MHz; Load Capacitance: 18pF; Operating Temperature: -40°C ~ 85°C; Ratings: -; Mounting Type: Surface Mount; Package / Case: 4-SMD, No Lead (DFN, LCC); Size / Dimension: 0.126" L x 0.098" W (3.20mm x 2.50mm); Height: 0.031" (0.80mm); ComponentLink1URL: http://www.abracon.com/Resonators/abm8.pdf; ComponentLink1Description: http://www.abracon.com/Resonators/abm8.pdf; Supplier Part Number 1: 535-10155-1-ND; .Checked SCH: used
Y2 = ABS06-32.768KHZ-9-1-T: CRYSTAL 32.768 KHZ 9.0 PF SMD; Manufacturer: Abracon Corporation; .Checked PCB: used; Frequency Stability: ±10ppm; Load Capacitance: 9pF; Operating Mode: Fundamental; .Checked SCH: used; Category: Crystals and Oscillators; Supplier Part Number: 535-10247-1-ND; Manufacturer Part Number: ABS06-32.768KHZ-9-1-T; Operating Temperature: -40°C ~ 85°C; Package / Case: 2-SMD, No Lead (DFN, LCC); Price 1k [$]: 1.24500; Value: 32.768kHz; Frequency: 32.768kHz; Supplier: Digikey; Supplier 1: Digi-Key; Supplier Part Number 1: 535-10247-1-ND; RoHS: RoHS Compliant; Stock 1: 5693; Pricing 1: 1=2.81, 10=2.438, 50=2.1376, 100=1.6875, 500=1.425 (USD); Type: kHz Crystal (Tuning Fork); Frequency Tolerance: ±10ppm; Mounting Type: Surface Mount; Size / Dimension: 0.079" L x 0.047" W (2.00mm x 1.20mm); Height: 0.024" (0.60mm); Packaging: Cut Tape (CT); ComponentLink1URL: http://www.abracon.com/Resonators/ABS06.pdf; ComponentLink1Description: http://www.abracon.com/Resonators/ABS06.pdf

## Sheet [12] - CPU - POWER.SchDoc
size A2; DocumentNumber: 12; SheetNumber: 12; SheetTotal: 32
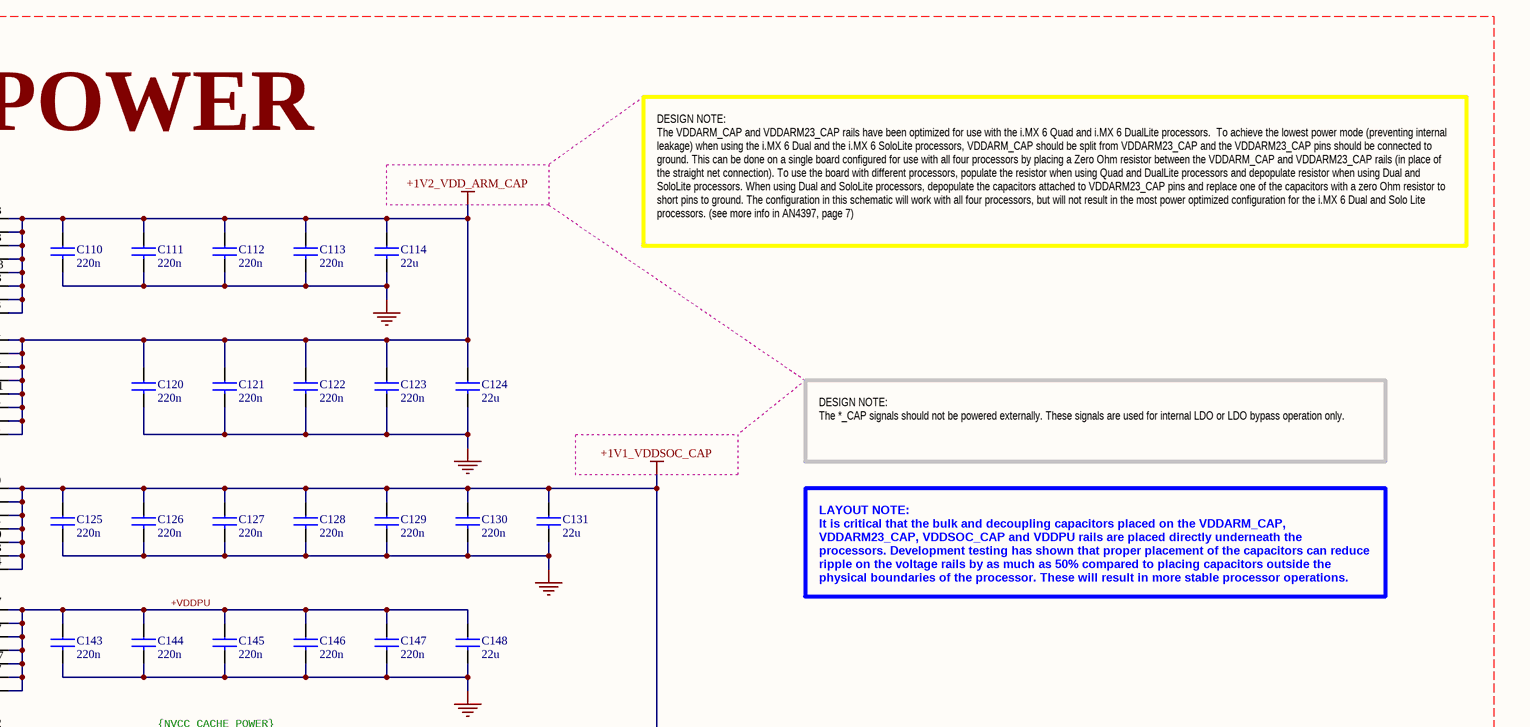
[diagram p34: [12] - CPU - POWER.SchDoc, top right]
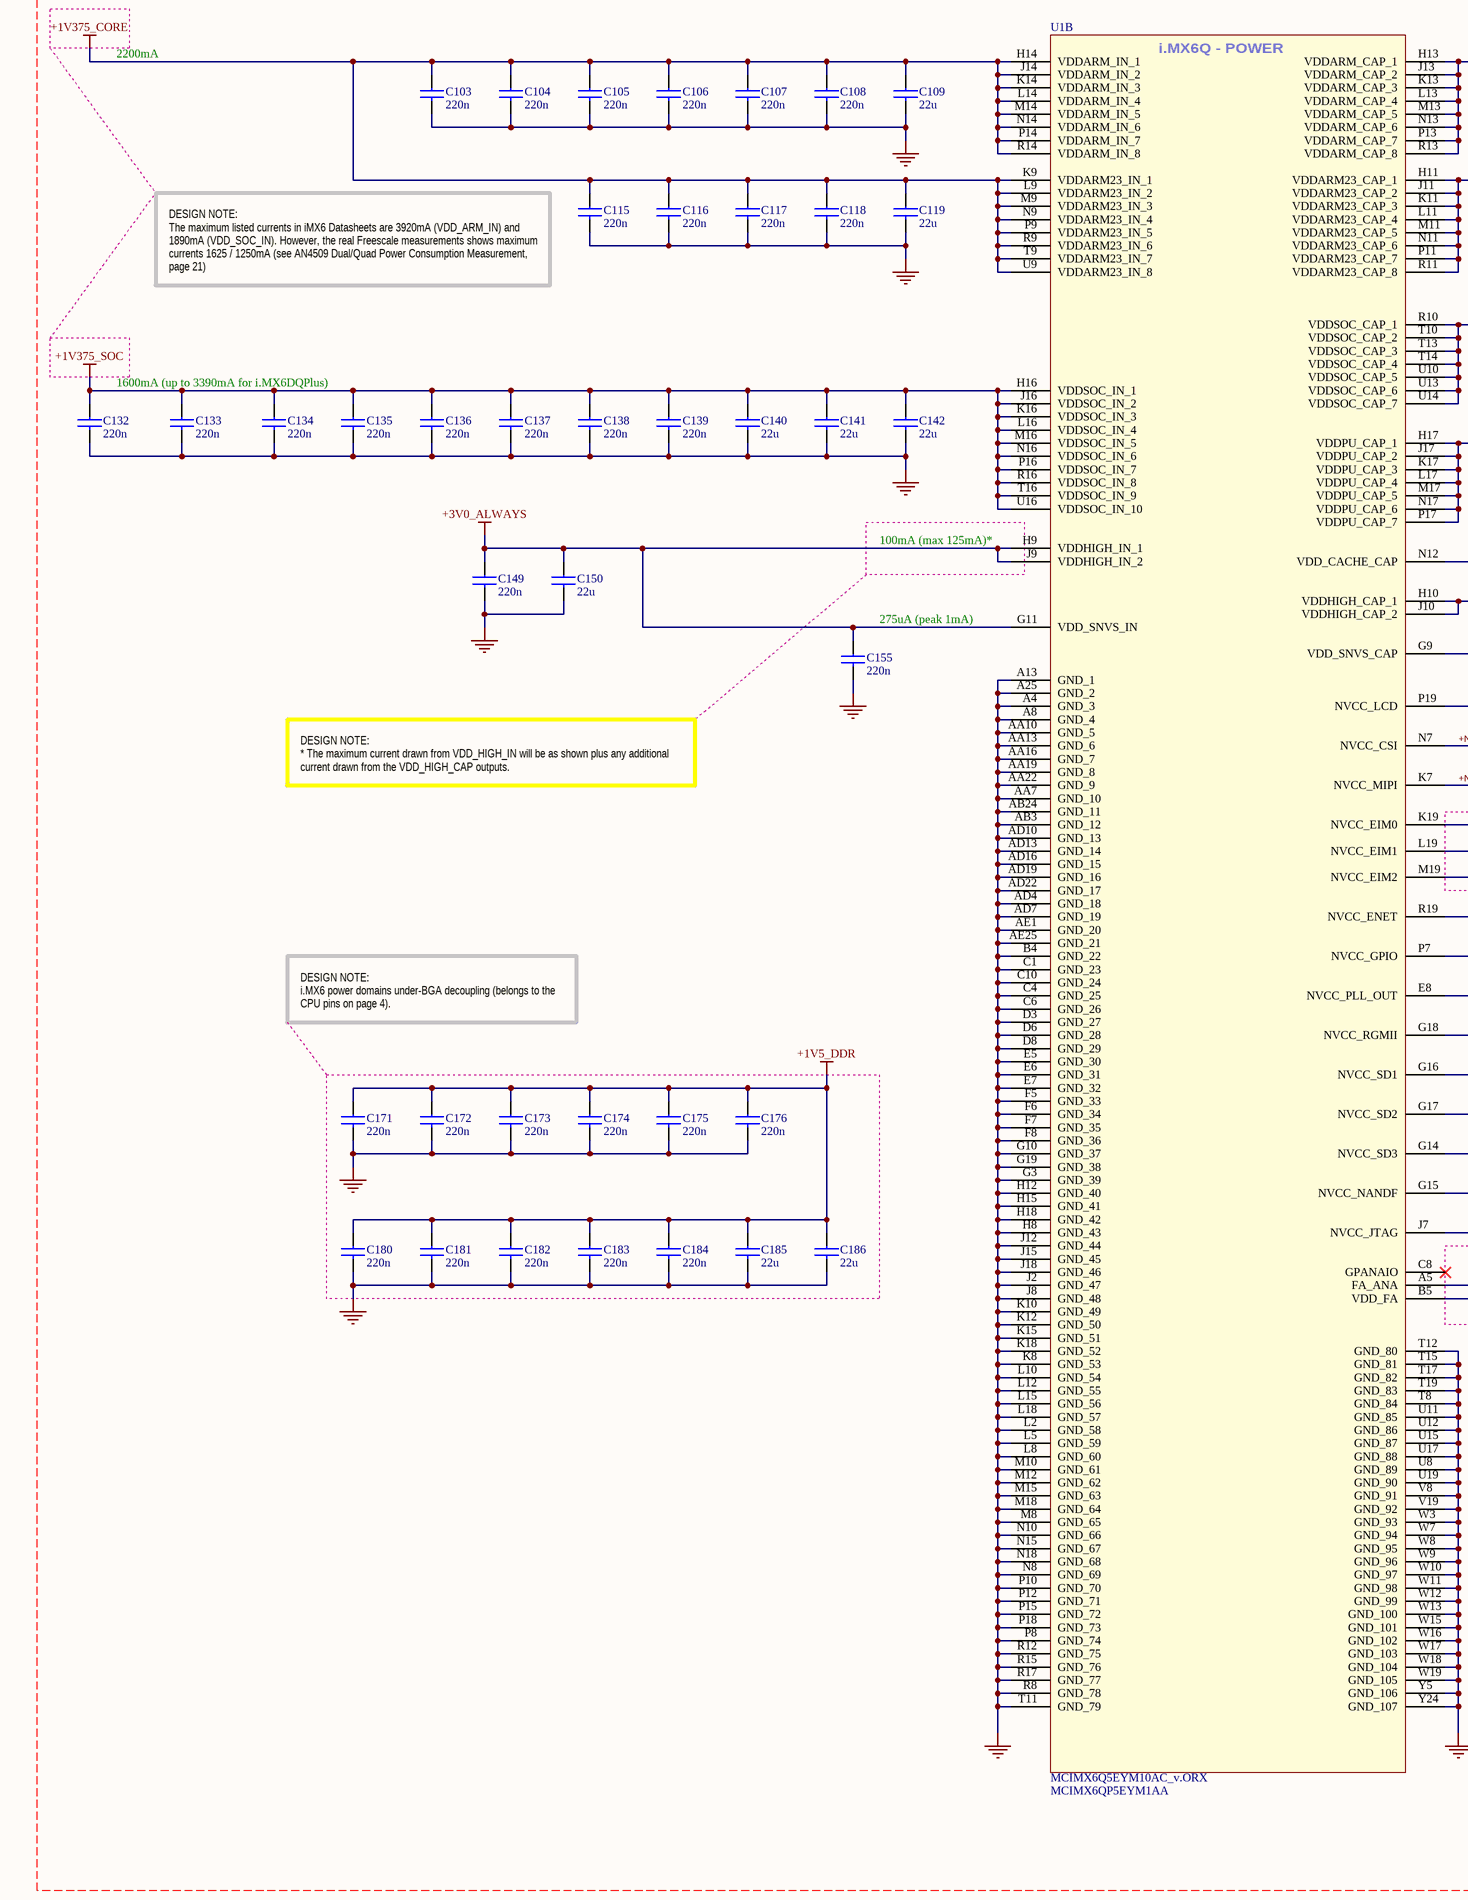
[diagram p35: [12] - CPU - POWER.SchDoc, bottom left]
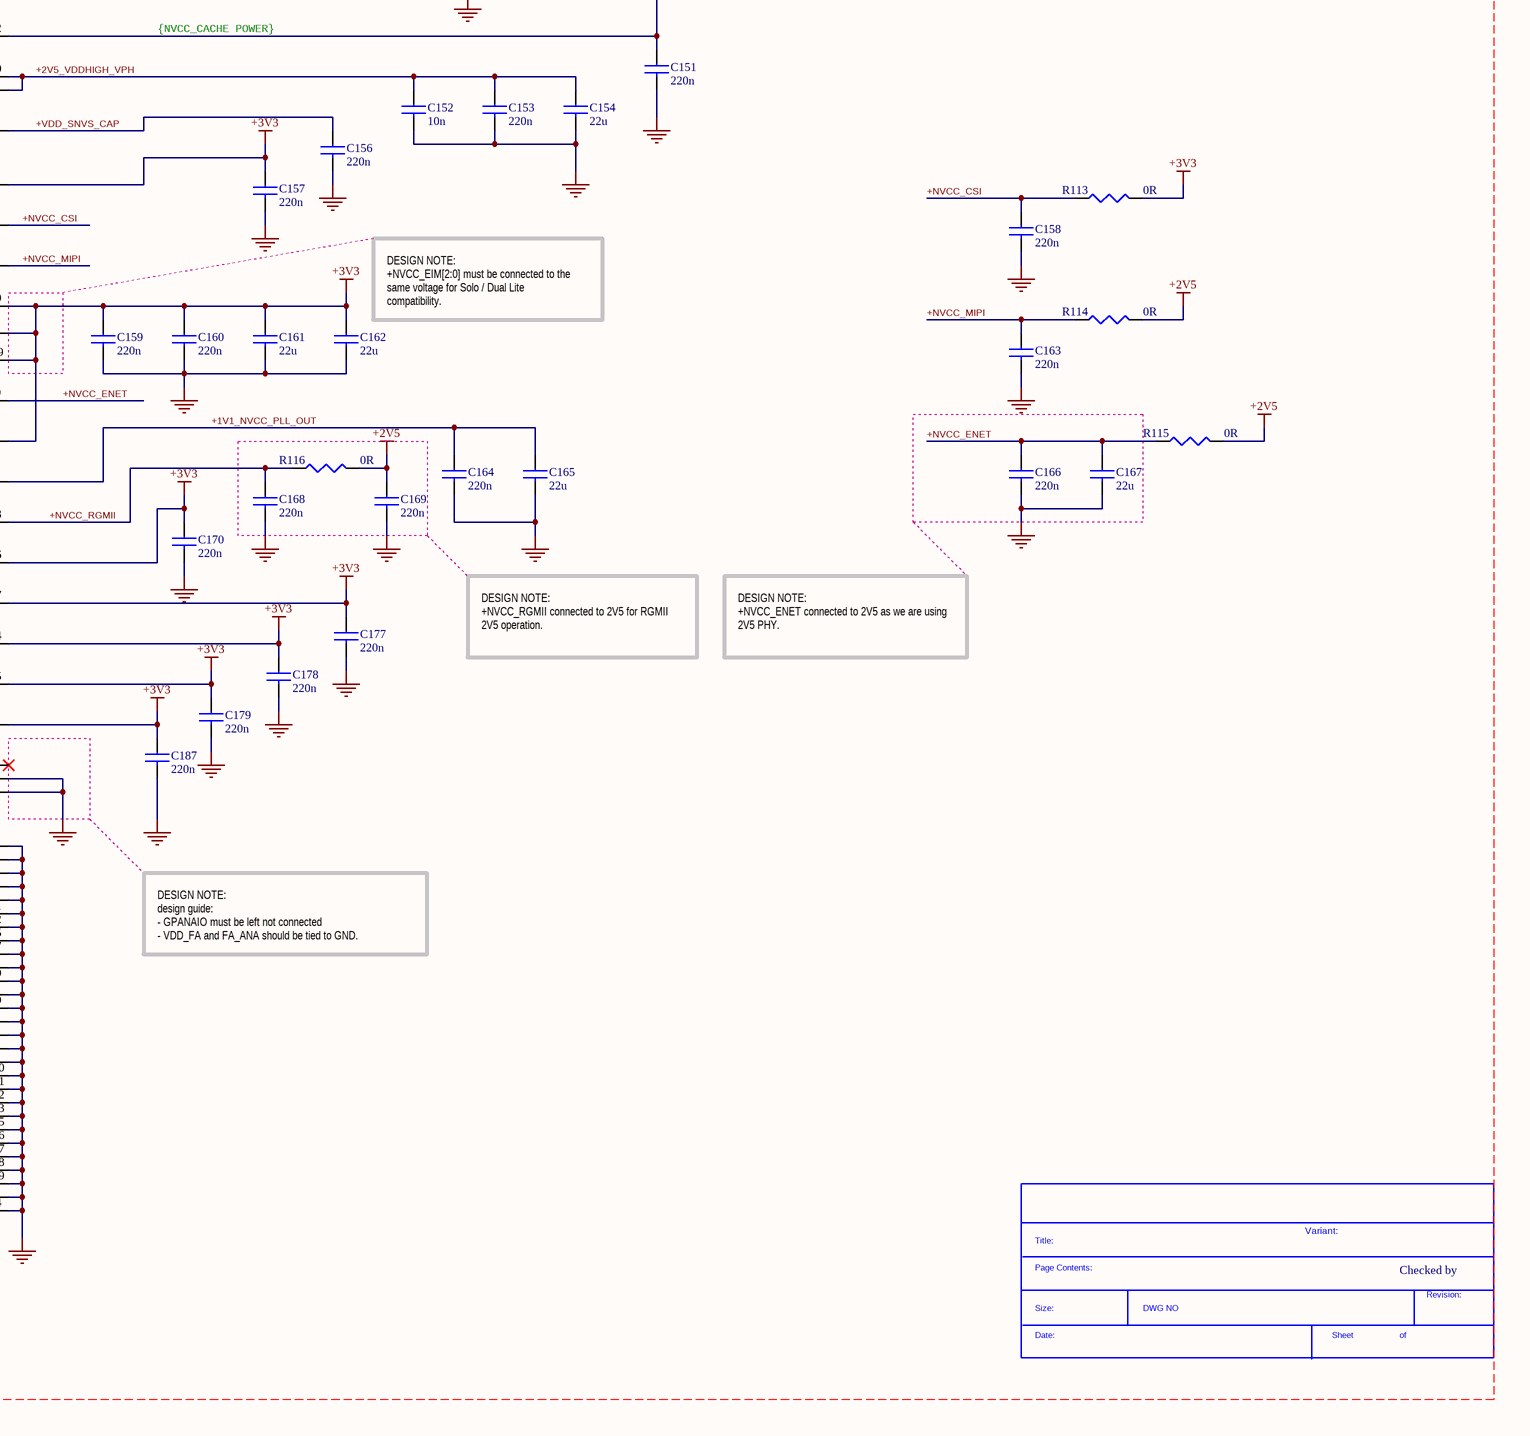
[diagram p36: [12] - CPU - POWER.SchDoc, bottom right]

### Parts
(Parts that share a designator on the sheet are numbered #1, #2 ... from top to bottom, then left to right.)
*#12  SDTitleBlock  (value not drawn)  (graphical)
C103  220n  [C0201]
C104  220n  [C0201]
C105  220n  [C0201]
C106  220n  [C0201]
C107  220n  [C0201]
C108  220n  [C0201]
C109  22u  [C0603_small]
C110  220n  [C0201]
C111  220n  [C0201]
C112  220n  [C0201]
C113  220n  [C0201]
C114  22u  [C0603_small]
C115  220n  [C0201]
C116  220n  [C0201]
C117  220n  [C0201]
C118  220n  [C0201]
C119  22u  [C0603_small]
C120  220n  [C0201]
C121  220n  [C0201]
C122  220n  [C0201]
C123  220n  [C0201]
C124  22u  [C0603_small]
C125  220n  [C0201]
C126  220n  [C0201]
C127  220n  [C0201]
C128  220n  [C0201]
C129  220n  [C0201]
C130  220n  [C0201]
C131  22u  [C0603_small]
C132  220n  [C0201]
C133  220n  [C0201]
C134  220n  [C0201]
C135  220n  [C0201]
C136  220n  [C0201]
C137  220n  [C0201]
C138  220n  [C0201]
C139  220n  [C0201]
C140  22u  [C0603_small]
C141  22u  [C0603_small]
C142  22u  [C0603_small]
C143  220n  [C0201]
C144  220n  [C0201]
C145  220n  [C0201]
C146  220n  [C0201]
C147  220n  [C0201]
C148  22u  [C0603_small]
C149  220n  [C0201]
C150  22u  [C0603]
C151  220n  [C0201]
C152  10n  [C0201]
C153  220n  [C0201]
C154  22u  [C0603]
C155  220n  [C0201]
C156  220n  [C0201]
C157  220n  [C0201]
C158  220n  [C0201]
C159  220n  [C0201]
C160  220n  [C0201]
C161  22u  [C0603]
C162  22u  [C0603]
C163  220n  [C0201]
C164  220n  [C0201]
C165  22u  [C0603]
C166  220n  [C0201]
C167  22u  [C0603]
C168  220n  [C0201]
C169  220n  [C0402]
C170  220n  [C0201]
C171  220n  [C0201]
C172  220n  [C0201]
C173  220n  [C0201]
C174  220n  [C0201]
C175  220n  [C0201]
C176  220n  [C0201]
C177  220n  [C0201]
C178  220n  [C0201]
C179  220n  [C0201]
C180  220n  [C0201]
C181  220n  [C0201]
C182  220n  [C0201]
C183  220n  [C0201]
C184  220n  [C0201]
C185  22u  [C0603_small]
C186  22u  [C0603_small]
C187  220n  [C0201]
R113  0R  [R0402]
R114  0R  [R0402]
R115  0R  [R0402]
R116  0R  [R0402]
U1  MCIMX6Q5EYM10AC_v.ORX  Supplier Part Number 2: MCIMX6QP5EYM1AA  [PBGA624]  (part B of 23)

### Nets
+1V1_VDDSOC_CAP: C125.1 C126.1 C127.1 C128.1 C129.1 C130.1 C131.1 C151.1 U1.N12(VDD_CACHE_CAP) U1.R10(VDDSOC_CAP_1) U1.T10(VDDSOC_CAP_2) U1.T13(VDDSOC_CAP_3) U1.T14(VDDSOC_CAP_4) U1.U10(VDDSOC_CAP_5) U1.U13(VDDSOC_CAP_6) U1.U14(VDDSOC_CAP_7)
+1V2_VDD_ARM_CAP: C110.1 C111.1 C112.1 C113.1 C114.1 C120.1 C121.1 C122.1 C123.1 C124.1 U1.H11(VDDARM23_CAP_1) U1.H13(VDDARM_CAP_1) U1.J11(VDDARM23_CAP_2) U1.J13(VDDARM_CAP_2) U1.K11(VDDARM23_CAP_3) U1.K13(VDDARM_CAP_3) U1.L11(VDDARM23_CAP_4) U1.L13(VDDARM_CAP_4) U1.M11(VDDARM23_CAP_5) U1.M13(VDDARM_CAP_5) U1.N11(VDDARM23_CAP_6) U1.N13(VDDARM_CAP_6) U1.P11(VDDARM23_CAP_7) U1.P13(VDDARM_CAP_7) U1.R11(VDDARM23_CAP_8) U1.R13(VDDARM_CAP_8)
+1V5_DDR: C171.1 C172.1 C173.1 C174.1 C175.1 C176.1 C180.1 C181.1 C182.1 C183.1 C184.1 C185.1 C186.1
+1V375_CORE: C103.1 C104.1 C105.1 C106.1 C107.1 C108.1 C109.1 C115.1 C116.1 C117.1 C118.1 C119.1 U1.H14(VDDARM_IN_1) U1.J14(VDDARM_IN_2) U1.K9(VDDARM23_IN_1) U1.K14(VDDARM_IN_3) U1.L9(VDDARM23_IN_2) U1.L14(VDDARM_IN_4) U1.M9(VDDARM23_IN_3) U1.M14(VDDARM_IN_5) U1.N9(VDDARM23_IN_4) U1.N14(VDDARM_IN_6) U1.P9(VDDARM23_IN_5) U1.P14(VDDARM_IN_7) U1.R9(VDDARM23_IN_6) U1.R14(VDDARM_IN_8) U1.T9(VDDARM23_IN_7) U1.U9(VDDARM23_IN_8)
+1V375_SOC: C132.1 C133.1 C134.1 C135.1 C136.1 C137.1 C138.1 C139.1 C140.1 C141.1 C142.1 U1.H16(VDDSOC_IN_1) U1.J16(VDDSOC_IN_2) U1.K16(VDDSOC_IN_3) U1.L16(VDDSOC_IN_4) U1.M16(VDDSOC_IN_5) U1.N16(VDDSOC_IN_6) U1.P16(VDDSOC_IN_7) U1.R16(VDDSOC_IN_8) U1.T16(VDDSOC_IN_9) U1.U16(VDDSOC_IN_10)
+2V5: C169.1 R114.2 R115.2 R116.2
+3V0_ALWAYS: C149.1 C150.1 C155.1 U1.G11(VDD_SNVS_IN) U1.H9(VDDHIGH_IN_1) U1.J9(VDDHIGH_IN_2)
+3V3: C157.1 C159.1 C160.1 C161.1 C162.1 C170.1 C177.1 C178.1 C179.1 C187.1 R113.2 U1.G14(NVCC_SD3) U1.G15(NVCC_NANDF) U1.G16(NVCC_SD1) U1.G17(NVCC_SD2) U1.J7(NVCC_JTAG) U1.K19(NVCC_EIM0) U1.L19(NVCC_EIM1) U1.M19(NVCC_EIM2) U1.P7(NVCC_GPIO) U1.P19(NVCC_LCD)
GND: C103.2 C104.2 C105.2 C106.2 C107.2 C108.2 C109.2 C110.2 C111.2 C112.2 C113.2 C114.2 C115.2 C116.2 C117.2 C118.2 C119.2 C120.2 C121.2 C122.2 C123.2 C124.2 C125.2 C126.2 C127.2 C128.2 C129.2 C130.2 C131.2 C132.2 C133.2 C134.2 C135.2 C136.2 C137.2 C138.2 C139.2 C140.2 C141.2 C142.2 C143.2 C144.2 C145.2 C146.2 C147.2 C148.2 C149.2 C150.2 C151.2 C152.2 C153.2 C154.2 C155.2 C156.2 C157.2 C158.2 C159.2 C160.2 C161.2 C162.2 C163.2 C164.2 C165.2 C166.2 C167.2 C168.2 C169.2 C170.2 C171.2 C172.2 C173.2 C174.2 C175.2 C176.2 C177.2 C178.2 C179.2 C180.2 C181.2 C182.2 C183.2 C184.2 C185.2 C186.2 C187.2 U1.A4(GND_3) U1.A5(FA_ANA) U1.A8(GND_4) U1.A13(GND_1) U1.A25(GND_2) U1.AA7(GND_10) U1.AA10(GND_5) U1.AA13(GND_6) U1.AA16(GND_7) U1.AA19(GND_8) U1.AA22(GND_9) U1.AB3(GND_12) U1.AB24(GND_11) U1.AD4(GND_18) U1.AD7(GND_19) U1.AD10(GND_13) U1.AD13(GND_14) U1.AD16(GND_15) U1.AD19(GND_16) U1.AD22(GND_17) U1.AE1(GND_20) U1.AE25(GND_21) U1.B4(GND_22) U1.B5(VDD_FA) U1.C1(GND_23) U1.C4(GND_25) U1.C6(GND_26) U1.C10(GND_24) U1.D3(GND_27) U1.D6(GND_28) U1.D8(GND_29) U1.E5(GND_30) U1.E6(GND_31) U1.E7(GND_32) U1.F5(GND_33) U1.F6(GND_34) U1.F7(GND_35) U1.F8(GND_36) U1.G3(GND_39) U1.G10(GND_37) U1.G19(GND_38) U1.H8(GND_43) U1.H12(GND_40) U1.H15(GND_41) U1.H18(GND_42) U1.J2(GND_47) U1.J8(GND_48) U1.J12(GND_44) U1.J15(GND_45) U1.J18(GND_46) U1.K8(GND_53) U1.K10(GND_49) U1.K12(GND_50) U1.K15(GND_51) U1.K18(GND_52) U1.L2(GND_58) U1.L5(GND_59) U1.L8(GND_60) U1.L10(GND_54) U1.L12(GND_55) U1.L15(GND_56) U1.L18(GND_57) U1.M8(GND_65) U1.M10(GND_61) U1.M12(GND_62) U1.M15(GND_63) U1.M18(GND_64) U1.N8(GND_69) U1.N10(GND_66) U1.N15(GND_67) U1.N18(GND_68) U1.P8(GND_74) U1.P10(GND_70) U1.P12(GND_71) U1.P15(GND_72) U1.P18(GND_73) U1.R8(GND_78) U1.R12(GND_75) U1.R15(GND_76) U1.R17(GND_77) U1.T8(GND_84) U1.T11(GND_79) U1.T12(GND_80) U1.T15(GND_81) U1.T17(GND_82) U1.T19(GND_83) U1.U8(GND_89) U1.U11(GND_85) U1.U12(GND_86) U1.U15(GND_87) U1.U17(GND_88) U1.U19(GND_90) U1.V8(GND_91) U1.V19(GND_92) U1.W3(GND_93) U1.W7(GND_94) U1.W8(GND_95) U1.W9(GND_96) U1.W10(GND_97) U1.W11(GND_98) U1.W12(GND_99) U1.W13(GND_100) U1.W15(GND_101) U1.W16(GND_102) U1.W17(GND_103) U1.W18(GND_104) U1.W19(GND_105) U1.Y5(GND_106) U1.Y24(GND_107)
+1V1_NVCC_PLL_OUT: C164.1 C165.1 U1.E8(NVCC_PLL_OUT)
+2V5_VDDHIGH_VPH: C152.1 C153.1 C154.1 U1.H10(VDDHIGH_CAP_1) U1.J10(VDDHIGH_CAP_2)
+NVCC_CSI: C158.1 R113.1 U1.N7(NVCC_CSI)
+NVCC_ENET: C166.1 C167.1 R115.1 U1.R19(NVCC_ENET)
+NVCC_MIPI: C163.1 R114.1 U1.K7(NVCC_MIPI)
+NVCC_RGMII: C168.1 R116.1 U1.G18(NVCC_RGMII)
+VDD_SNVS_CAP: C156.1 U1.G9(VDD_SNVS_CAP)
+VDDPU: C143.1 C144.1 C145.1 C146.1 C147.1 C148.1 U1.H17(VDDPU_CAP_1) U1.J17(VDDPU_CAP_2) U1.K17(VDDPU_CAP_3) U1.L17(VDDPU_CAP_4) U1.M17(VDDPU_CAP_5) U1.N17(VDDPU_CAP_6) U1.P17(VDDPU_CAP_7)

Not connected (* = marked no-connect by the designer): U1 C8(GPANAIO)*

### Layout directives
net class [12] - CPU - POWER: +1V1_NVCC_PLL_OUT, +1V1_VDDSOC_CAP, +1V2_VDD_ARM_CAP, +1V5_DDR, +1V375_CORE, +1V375_SOC, +2V5, +2V5_VDDHIGH_VPH, +3V0_ALWAYS, +3V3, +NVCC_CSI, +NVCC_ENET, +NVCC_MIPI, +NVCC_RGMII, +VDD_SNVS_CAP, +VDDPU, GND

### Notes on the sheet
- CPU - POWER
- 2200mA
- DESIGN NOTE:
  The VDDARM_CAP and VDDARM23_CAP rails have been optimized for use with the i.MX 6 Quad and i.MX 6 DualLite processors.  To achieve the lowest power mode (preventing internal leakage) when using the i.MX 6 Dual and the i.MX 6 SoloLite processors, VDDARM_CAP should be split from VDDARM23_CAP and the VDDARM23_CAP pins should be connected to ground. This can be done on a single board configured for use with all four processors by placing a Zero Ohm resistor between the VDDARM_CAP and VDDARM23_CAP rails (in place of the straight net connection). To use the board with different processors, populate the resistor when using Quad and DualLite processors and depopulate resistor when using Dual and SoloLite processors. When using Dual and SoloLite processors, depopulate the capacitors attached to VDDARM23_CAP pins and replace one of the capacitors with a zero Ohm resistor to short pins to ground. The configuration in this schematic will work with all four processors, but will not result in the most power optimized configuration for the i.MX 6 Dual and Solo Lite processors. (see more info in AN4397, page 7)
- (near C115) DESIGN NOTE:
  The maximum listed currents in iMX6 Datasheets are 3920mA (VDD_ARM_IN) and 1890mA (VDD_SOC_IN). However, the real Freescale measurements shows maximum currents 1625 / 1250mA (see AN4509 Dual/Quad Power Consumption Measurement, page 21)
- DESIGN NOTE:
  The *_CAP signals should not be powered externally. These signals are used for internal LDO or LDO bypass operation only.
- 1600mA (up to 3390mA for i.MX6DQPlus)
- LAYOUT NOTE:
  It is critical that the bulk and decoupling capacitors placed on the VDDARM_CAP, VDDARM23_CAP, VDDSOC_CAP and VDDPU rails are placed directly underneath the processors. Development testing has shown that proper placement of the capacitors can reduce ripple on the voltage rails by as much as 50% compared to placing capacitors outside the physical boundaries of the processor. These will result in more stable processor operations.
- 100mA (max 125mA)*
- {NVCC_CACHE POWER}
- (near C155) 275uA (peak 1mA)
- DESIGN NOTE:
  * The maximum current drawn from VDD_HIGH_IN will be as shown plus any additional current drawn from the VDD_HIGH_CAP outputs.
- (near C162) DESIGN NOTE:
  +NVCC_EIM[2:0] must be connected to the same voltage for Solo / Dual Lite compatibility.
- DESIGN NOTE:
  i.MX6 power domains under-BGA decoupling (belongs to the CPU pins on page 4).
- DESIGN NOTE:
  +NVCC_RGMII connected to 2V5 for RGMII 2V5 operation.
- DESIGN NOTE:
  +NVCC_ENET connected to 2V5 as we are using 2V5 PHY.
- DESIGN NOTE:
  design guide:
  - GPANAIO must be left not connected
  - VDD_FA and FA_ANA should be tied to GND.
- Variant:
- Checked by
- (in symbol MCIMX6Q5EYM10AC_v.ORX, part B) i.MX6Q - POWER
- (in symbol SDTitleBlock) Title:; Page Contents:; Revision:; Size:; DWG NO; Date:; Sheet; of

### Library data of the parts
C103-C108 C110-C113 C115-C118 C120-C123 C125-C130 C132-C139 C143-C147 C149 C151 C153 C155-C160 C163 C164 C166 C168 C170-C184 C187 = C0603X5R0J224M030BB: CAP CER 0.22UF 6.3V 20% X5R 0201; Manufacturer: TDK Corporation; Capacitance: 0.22µF; .Checked PCB: used; .Creator: MM; Supplier 1: Digi-Key; Manufacturer Part Number: C0603X5R0J224M030BB; RoHS: RoHS Compliant; Category: Capacitors; Stock 1: 205900; Pricing 1: 1=0.15, 10=0.102, 100=0.0485, 250=0.0408, 500=0.03418, 1000=0.0275, 5000=0.02325 (USD); Packaging: Cut Tape (CT); Tolerance: ±20%; Voltage - Rated: 6.3V; Temperature Coefficient: X5R; Mounting Type: Surface Mount, MLCC; Operating Temperature: -55°C ~ 85°C; Applications: General Purpose; Ratings: -; Package / Case: 0201 (0603 Metric); Size / Dimension: 0.024" L x 0.012" W (0.60mm x 0.30mm); Height - Seated (Max): -; Thickness (Max): 0.013" (0.33mm); Lead Spacing: -; Features: -; Lead Style: -; ComponentLink1URL: http://product.tdk.com/en/catalog/datasheets/mlcc_commercial_general_en.pdf; ComponentLink1Description: http://product.tdk.com/en/catalog/datasheets/mlcc_commercial_general_en.pdf; Supplier Part Number 1: 445-5929-1-ND; .Checked SCH: used; Supplier 2: Digi-Key; Supplier Part Number 2: 1276-1042-6-ND
C109 C114 C119 C124 C131 C140-C142 C148 C185 C186 = GRM188R60G226MEA0L_small: CAP CER 22UF 4V 20% X5R 0603; Manufacturer: Murata Electronics North America; Capacitance: 22µF; .Checked PCB: used; .Creator: MM; Supplier 1: Digi-Key; Supplier Part Number 1: 490-5526-1-ND; Manufacturer Part Number: GRM188R60G226MEA0L; RoHS: RoHS Compliant; Category: Capacitors; Stock 1: 5760; Pricing 1: 1=0.79, 10=0.663, 50=0.4752, 100=0.4158, 250=0.32672, 500=0.297, 1000=0.2376 (USD); Voltage - Rated: 4V; Tolerance: ±20%; Temperature Coefficient: X5R; Mounting Type: Surface Mount, MLCC; Operating Temperature: -55°C ~ 85°C; Applications: General Purpose; Ratings: -; Package / Case: 0603 (1608 Metric); Size / Dimension: 0.063" L x 0.031" W (1.60mm x 0.80mm); Height - Seated (Max): -; Thickness (Max): 0.035" (0.90mm); Lead Spacing: -; Features: -; Packaging: Cut Tape (CT); Lead Style: -; ComponentLink1URL: http://www.murata.com/products/catalog/pdf/c02e.pdf; ComponentLink1Description: http://www.murata.com/products/catalog/pdf/c02e.pdf; .Checked SCH: used
C150 C154 C161 C162 C165 C167 = C1608X5R0J226M080AC: CAP CER 22UF 6.3V 20% X5R 0603; Manufacturer: TDK Corporation; Capacitance: 22µF; .Creator: MM; .Checked PCB: used; Supplier 1: Digi-Key; Manufacturer Part Number: C1608X5R0J226M080AC; RoHS: RoHS Compliant; Category: Capacitors; Stock 1: 593047; Pricing 1: 1=0.39, 10=0.343, 100=0.1714, 250=0.13708, 500=0.12484, 1000=0.1104 (USD); Packaging: Cut Tape (CT); Tolerance: ±20%; Voltage - Rated: 6.3V; Temperature Coefficient: X5R; Mounting Type: Surface Mount, MLCC; Operating Temperature: -55°C ~ 85°C; Applications: General Purpose; Ratings: -; Package / Case: 0603 (1608 Metric); Size / Dimension: 0.063" L x 0.031" W (1.60mm x 0.80mm); Height - Seated (Max): -; Thickness (Max): 0.039" (1.00mm); Lead Spacing: -; Features: -; Lead Style: -; ComponentLink1URL: http://product.tdk.com/en/catalog/datasheets/mlcc_commercial_general_en.pdf; ComponentLink1Description: http://product.tdk.com/en/catalog/datasheets/mlcc_commercial_general_en.pdf; Supplier Part Number 1: 445-8028-1-ND; .Checked SCH: used
C152 = C0603X5R1C103K030BA: CAP CER .01UF 16V 10% X5R 0201; Manufacturer: TDK Corporation; Capacitance: 10000pF; .Creator: MM; .Checked PCB: used; Supplier 1: Digi-Key; Manufacturer Part Number: C0603X5R1C103K030BA; RoHS: RoHS Compliant; Category: Capacitors; Stock 1: 24793; Pricing 1: 1=0.1, 10=0.043, 100=0.0196, 250=0.01608, 500=0.01374, 1000=0.0105, 5000=0.00875 (USD); Packaging: Cut Tape (CT); Tolerance: ±10%; Voltage - Rated: 16V; Temperature Coefficient: X5R; Mounting Type: Surface Mount, MLCC; Operating Temperature: -55°C ~ 85°C; Applications: General Purpose; Ratings: -; Package / Case: 0201 (0603 Metric); Size / Dimension: 0.024" L x 0.012" W (0.60mm x 0.30mm); Height - Seated (Max): -; Thickness (Max): 0.013" (0.33mm); Lead Spacing: -; Features: -; Lead Style: -; ComponentLink1URL: http://product.tdk.com/en/catalog/datasheets/mlcc_commercial_general_en.pdf; ComponentLink1Description: http://product.tdk.com/en/catalog/datasheets/mlcc_commercial_general_en.pdf; Supplier Part Number 1: 445-16166-1-ND; .Checked SCH: used; Supplier 2: Digi-Key; Supplier Part Number 2: 490-7194-1-ND
C169 = C1005X5R1E224M: CAP CER .22UF 25V X5R 20% 0402; Manufacturer: TDK Corporation; Capacitance: 0.22µF; Value: 220nF; .Checked PCB: used; Category: Capacitors; Supplier Part Number: 445-5945-1-ND; Manufacturer Part Number: C1005X5R1E224M; Operating Temperature: -55°C ~ 85°C; Package / Case: 0402 (1005 Metric); Price 1k [$]: 0.02600; .Checked SCH: used; Voltage - Rated: 25V; Supplier: Digikey; Supplier 1: Digi-Key; Supplier Part Number 1: 445-5945-1-ND; RoHS: RoHS Compliant; Stock 1: 54593; Pricing 1: 1=0.3, 10=0.2, 100=0.08, 250=0.05752, 500=0.041, 1000=0.03 (USD); Tolerance: ±20%; Temperature Coefficient: X5R; Mounting Type: Surface Mount, MLCC; Applications: General Purpose; Ratings: -; Size / Dimension: 0.039" L x 0.020" W (1.00mm x 0.50mm); Height - Seated (Max): -; Thickness (Max): 0.022" (0.55mm); Lead Spacing: -; Features: -; Packaging: Cut Tape (CT); Lead Style: -; ComponentLink1URL: http://www.tdk.co.jp/tefe02/e412_c.pdf; ComponentLink1Description: http://www.tdk.co.jp/tefe02/e412_c.pdf; Supplier 2: Digi-Key; Supplier Part Number 2: 587-1452-1-ND
R113-R116 = RC0402JR-070RL: as R93 on sheet [11] - CPU - JTAG, CONTROL; Category: Resistors; Supplier Part Number: 311-0.0JRCT-ND; Manufacturer Part Number: RC0402JR-070RL; Package / Case: 0402 (1005 Metric); Price 1k [$]: 0.01389; Value: 0R; .Checked SCH: used; Supplier: Digikey; Supplier 1: Digi-Key; Supplier Part Number 1: 311-0.0JRCT-ND; RoHS: RoHS Compliant; Stock 1: 1106330; Pricing 1: 10=0.012, 50=0.009, 100=0.0069, 250=0.00512, 500=0.0038, 1000=0.00253 (USD); Composition: Thick Film; Features: -; Temperature Coefficient: -; Size / Dimension: 0.039" L x 0.020" W (1.00mm x 0.50mm); Height: 0.016" (0.40mm); Number of Terminations: 2; Packaging: Cut Tape (CT); ComponentLink1URL: http://www.yageo.com/documents/recent/PYu-RC0402_51_RoHS_L_6.pdf; ComponentLink1Description: http://www.yageo.com/documents/recent/PYu-RC0402_51_RoHS_L_6.pdf
U1 = MCIMX6Q5EYM10AC_v.ORX: as U1 on sheet [11] - CPU - JTAG, CONTROL; Supplier 1: Digi-Key; Manufacturer Part Number: MCIMX6Q5EYM10AC; RoHS: RoHS Compliant; Category: Integrated Circuits (ICs); Stock 1: 0; Pricing 1: 1=54.98, 10=51.922, 25=48.868, 100=30.5424 (USD); Program Memory Size: -; EEPROM Size: -; Data Converters: -; Operating Temperature: -20°C ~ 105°C; Package / Case: 624-FBGA, FCBGA; Packaging: Tray; ComponentLink1URL: http://cache.freescale.com/files/32bit/doc/data_sheet/IMX6DQCEC.pdf; ComponentLink1Description: Data Sheet; Supplier Part Number 1: MCIMX6Q5EYM10AC-ND; .Checked SCH: used; ComponentLink2Description: User Guide; ComponentLink2URL: file:///C:/Users/mbeach/Downloads/i.MX_Linux_User's_Guide.pdf; Supplier 2: Arrow